# EAGLE design qo-100-opi-dock (EAGLE 9.6.1)
CNAME: None; CREVISION: 1; DESIGNER: Joao Silva

## Sheet 1 of 5: SBC
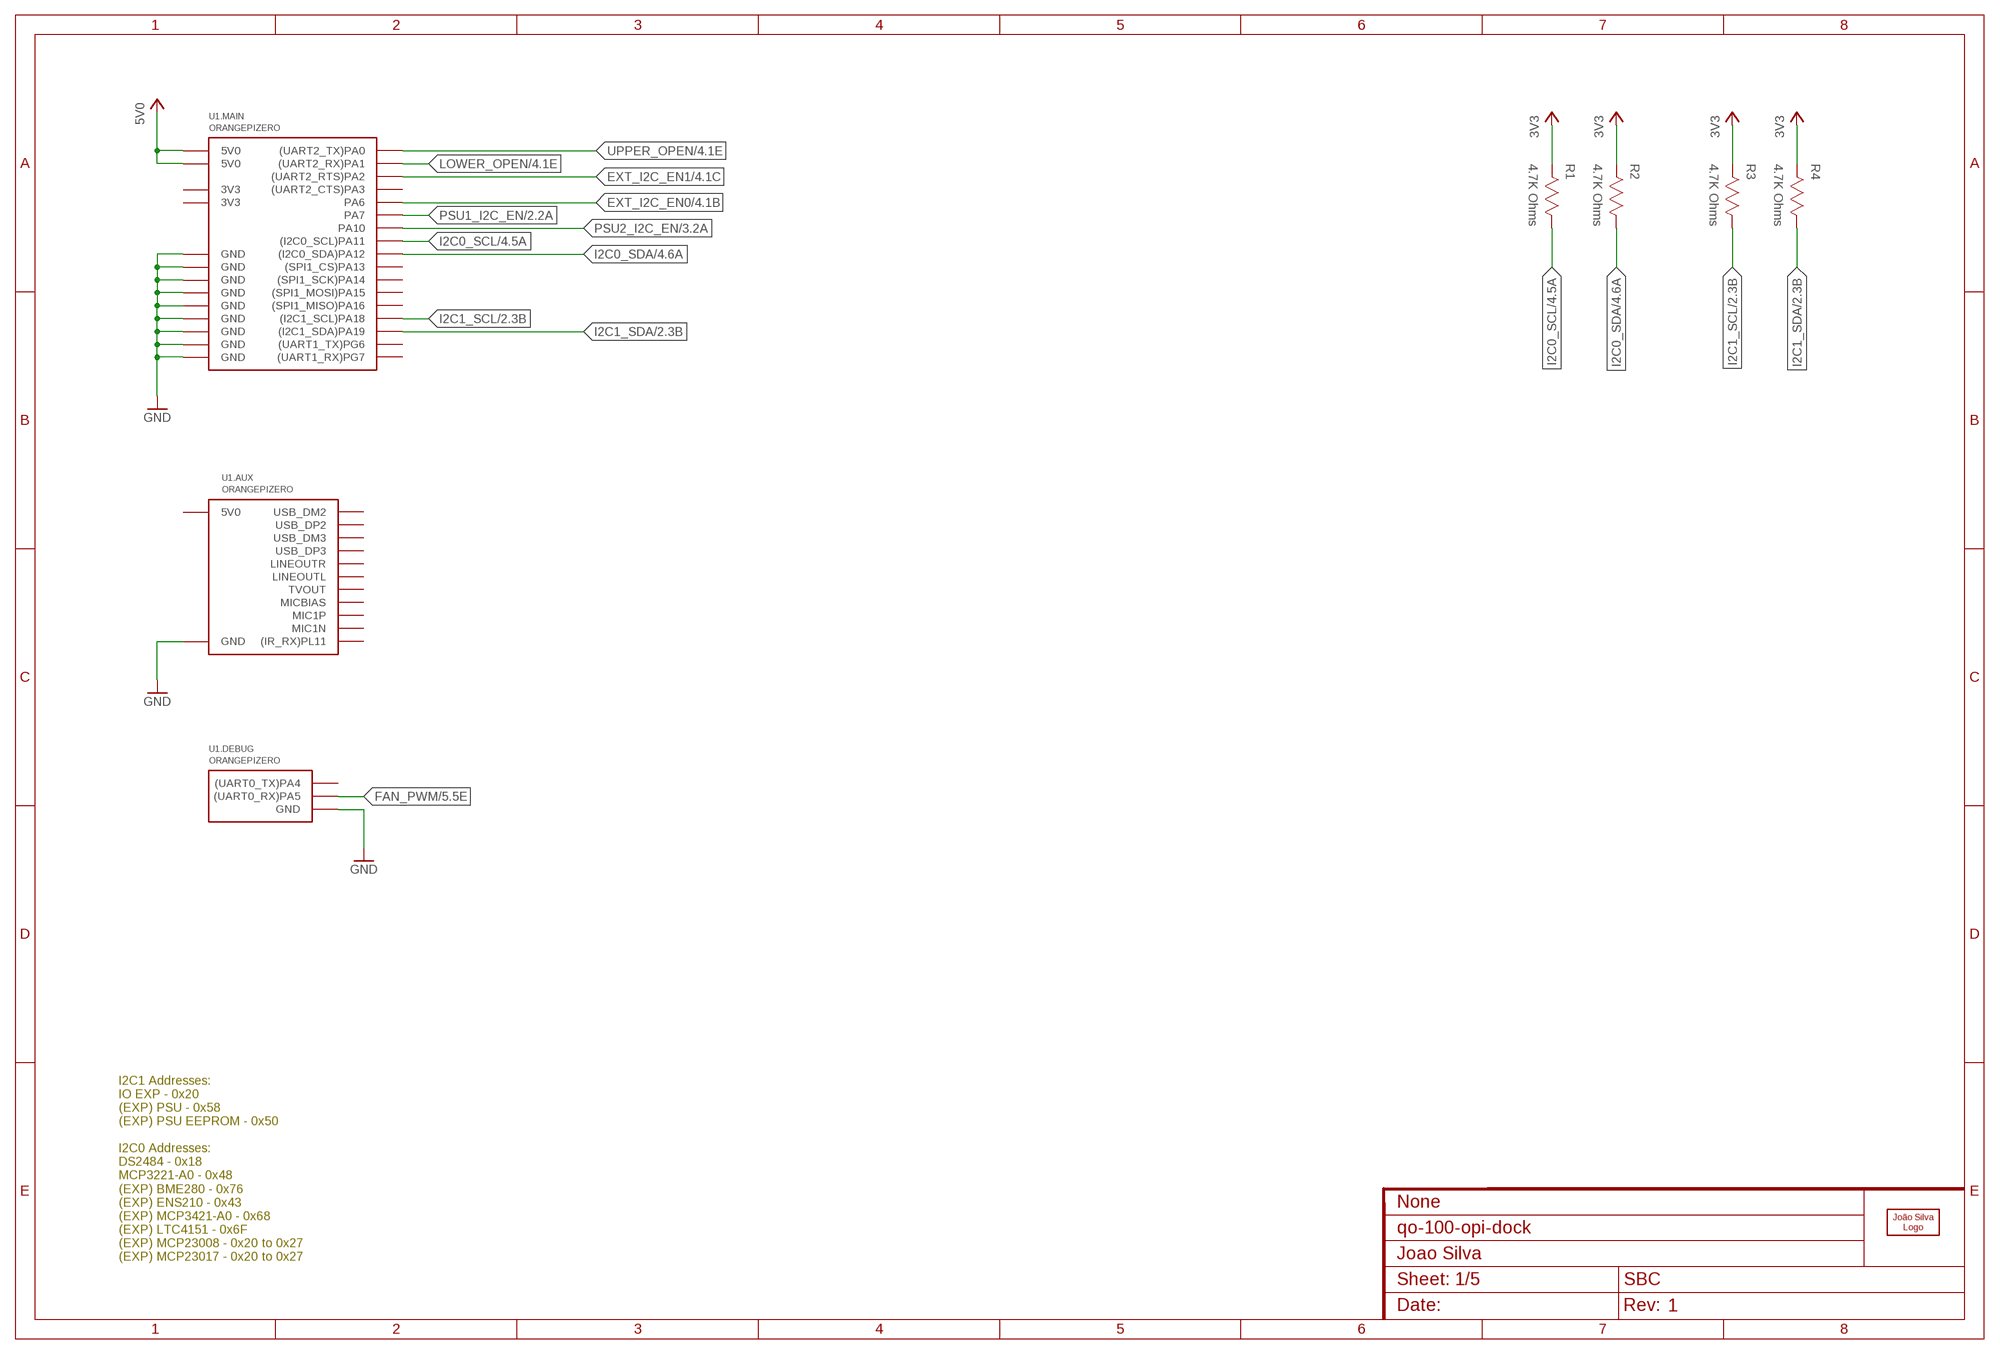
[diagram p0: schematic, sheet 1]

### Parts
LOGO1  JS-5MM  [JS_5MM]
R1  4.7K Ohms  RESISTOR-0603  [RES0603]
R2  4.7K Ohms  RESISTOR-0603  [RES0603]
R3  4.7K Ohms  RESISTOR-0603  [RES0603]
R4  4.7K Ohms  RESISTOR-0603  [RES0603]
U1  ORANGEPIZERO  [ORANGEPIZERO]

### Nets
3V3: R1.2 R2.2 R3.2 R4.2 ; also sheet 2,3,4,5
5V0: U1.MH$2(.MAIN:5V0) U1.MH$4(.MAIN:5V0) ; also sheet 5
EXT_I2C_EN0: U1.MH$7(.MAIN:PA6) ; also sheet 4
EXT_I2C_EN1: U1.MH$22(.MAIN:(UART2_RTS)PA2) ; also sheet 4
FAN_PWM: U1.DBG$2(.DEBUG:(UART0_RX)PA5) ; also sheet 5
GND: U1.DBG$1(.DEBUG:GND) U1.GND@0(.MAIN:GND) U1.GND@1(.MAIN:GND) U1.GND@2(.MAIN:GND) U1.GND@3(.MAIN:GND) U1.MH$6(.MAIN:GND) U1.MH$9(.MAIN:GND) U1.MH$14(.MAIN:GND) U1.MH$20(.MAIN:GND) U1.MH$25(.MAIN:GND) U1.SH$2(.AUX:GND) ; also sheet 2,3,4,5
I2C0_SCL: R1.1 U1.MH$5(.MAIN:(I2C0_SCL)PA11) ; also sheet 4,5
I2C0_SDA: R2.1 U1.MH$3(.MAIN:(I2C0_SDA)PA12) ; also sheet 4,5
I2C1_SCL: R3.1 U1.MH$18(.MAIN:(I2C1_SCL)PA18) ; also sheet 2,3
I2C1_SDA: R4.1 U1.MH$16(.MAIN:(I2C1_SDA)PA19) ; also sheet 2,3
LOWER_OPEN: U1.MH$11(.MAIN:(UART2_RX)PA1) ; also sheet 4
PSU1_I2C_EN: U1.MH$12(.MAIN:PA7) ; also sheet 2
PSU2_I2C_EN: U1.MH$26(.MAIN:PA10) ; also sheet 3
UPPER_OPEN: U1.MH$13(.MAIN:(UART2_TX)PA0) ; also sheet 4
Unconnected: U1.DBG$3(.DEBUG:(UART0_TX)PA4) U1.MH$1(.MAIN:3V3) U1.MH$8(.MAIN:(UART1_TX)PG6) U1.MH$10(.MAIN:(UART1_RX)PG7) U1.MH$15(.MAIN:(UART2_CTS)PA3) U1.MH$17(.MAIN:3V3) U1.MH$19(.MAIN:(SPI1_MOSI)PA15) U1.MH$21(.MAIN:(SPI1_MISO)PA16) U1.MH$23(.MAIN:(SPI1_SCK)PA14) U1.MH$24(.MAIN:(SPI1_CS)PA13) U1.SH$1(.AUX:5V0) U1.SH$3(.AUX:USB_DM2) U1.SH$4(.AUX:USB_DP2) U1.SH$5(.AUX:USB_DM3) U1.SH$6(.AUX:USB_DP3) U1.SH$7(.AUX:LINEOUTR) U1.SH$8(.AUX:LINEOUTL) U1.SH$9(.AUX:TVOUT) U1.SH$10(.AUX:MICBIAS) U1.SH$11(.AUX:MIC1P) U1.SH$12(.AUX:MIC1N) U1.SH$13(.AUX:(IR_RX)PL11)

### Notes on the sheet
- I2C1 Addresses:
  IO EXP - 0x20
  (EXP) PSU - 0x58
  (EXP) PSU EEPROM - 0x50
  
  I2C0 Addresses:
  DS2484 - 0x18
  MCP3221-A0 - 0x48
  (EXP) BME280 - 0x76
  (EXP) ENS210 - 0x43
  (EXP) MCP3421-A0 - 0x68
  (EXP) LTC4151 - 0x6F
  (EXP) MCP23008 - 0x20 to 0x27
  (EXP) MCP23017 - 0x20 to 0x27

## Sheet 2 of 5: PSU #1 Interface
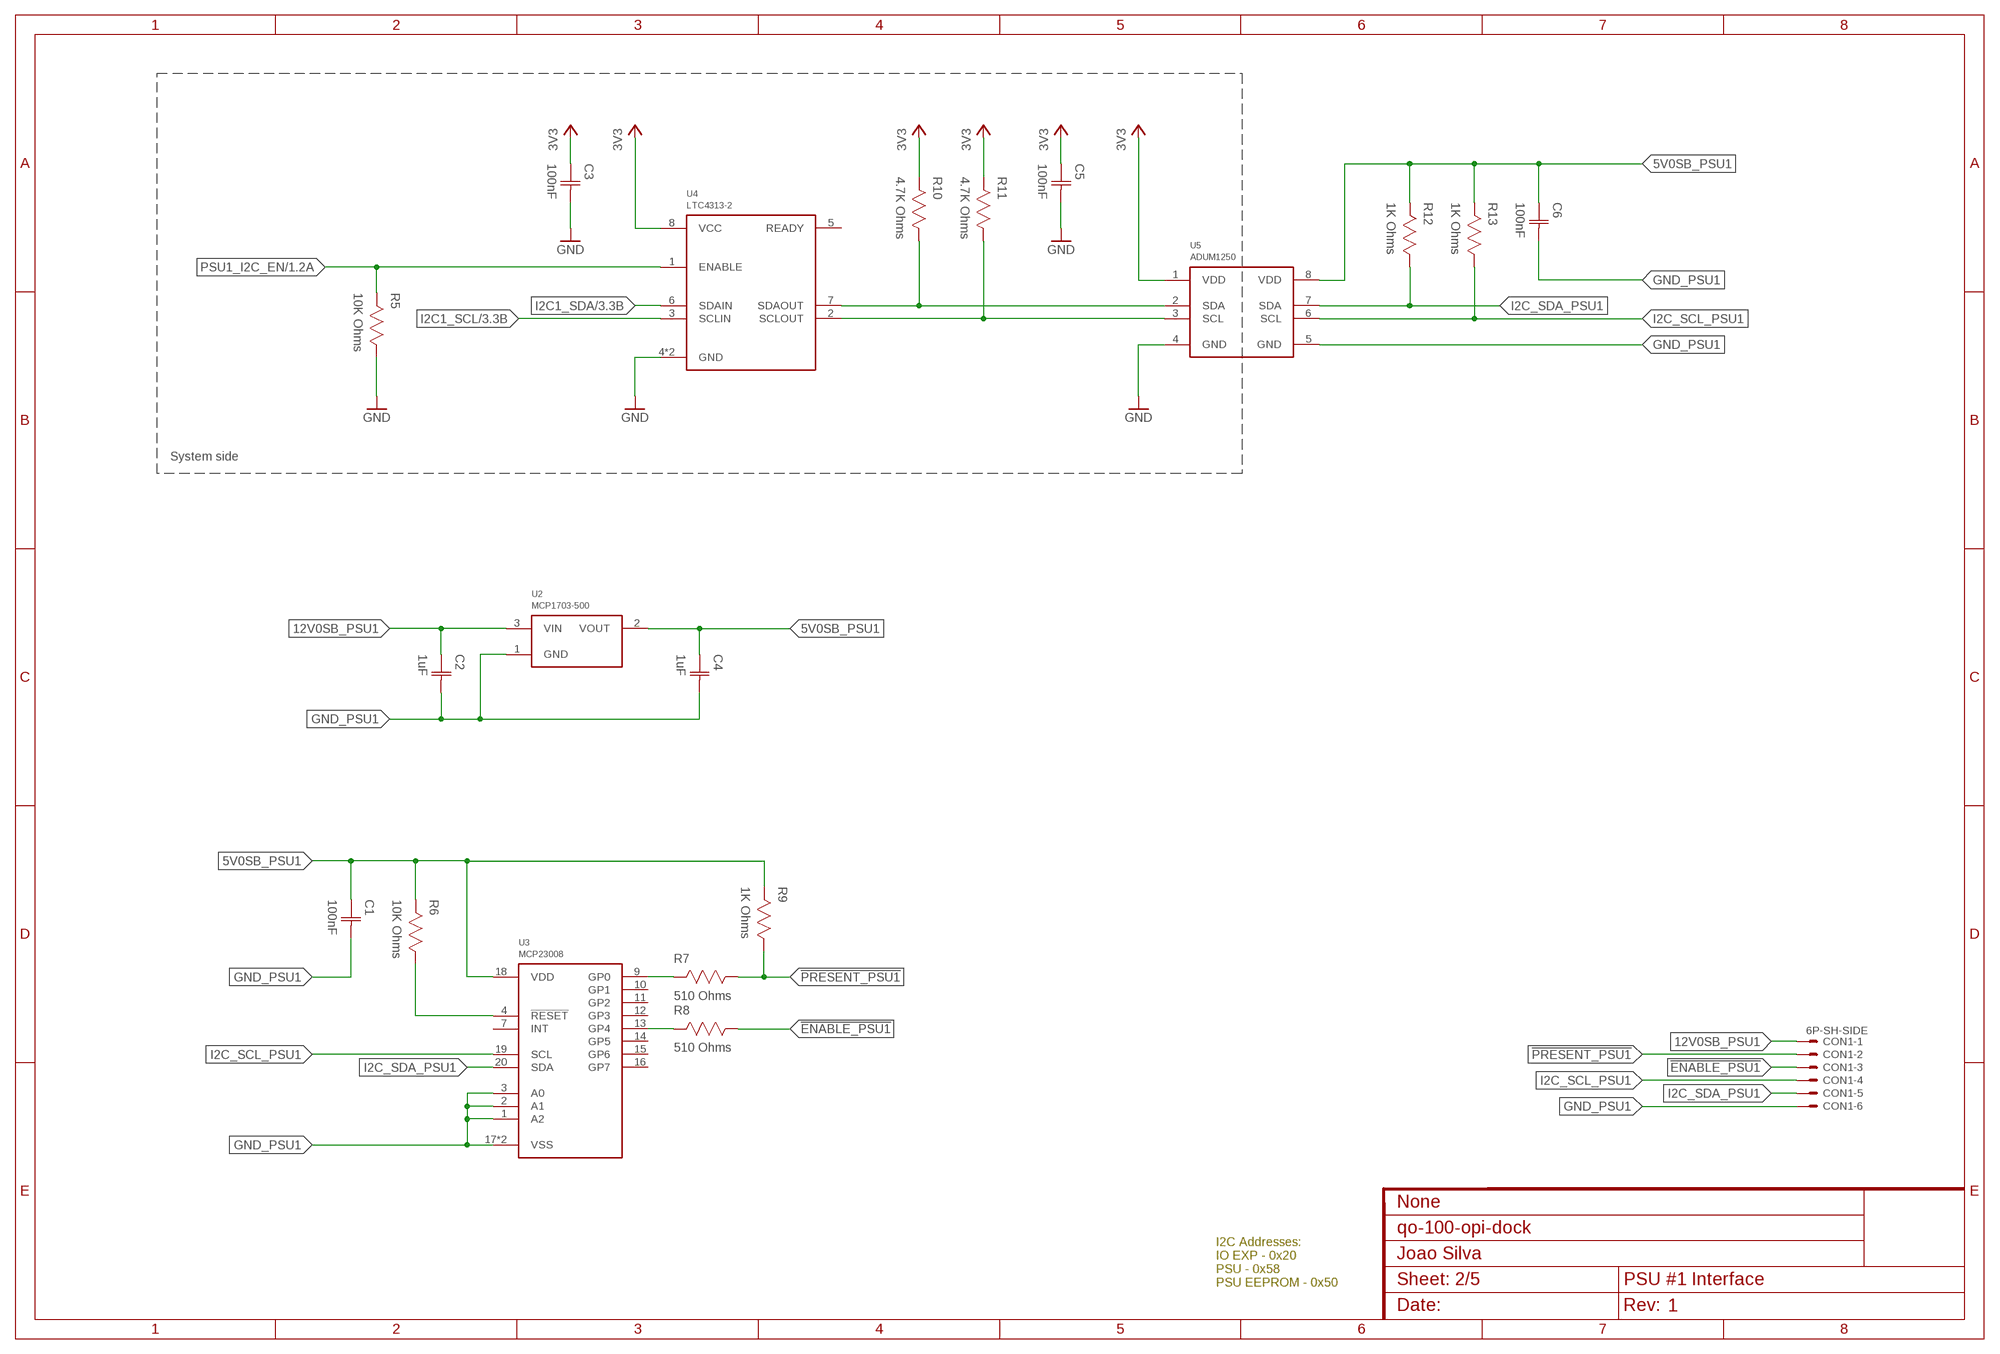
[diagram p1: schematic, sheet 2]

### Parts
C1  100nF  CAPACITOR-0603  [CAP0603]
C2  1uF  CAPACITOR-0603  [CAP0603]
C3  100nF  CAPACITOR-0603  [CAP0603]
C4  1uF  CAPACITOR-0603  [CAP0603]
C5  100nF  CAPACITOR-0603  [CAP0603]
C6  100nF  CAPACITOR-0603  [CAP0603]
CON1  6P-SH-SIDE  [SH-06-SIDE]
R5  10K Ohms  RESISTOR-0603  [RES0603]
R6  10K Ohms  RESISTOR-0603  [RES0603]
R7  510 Ohms  RESISTOR-0603  [RES0603]
R8  510 Ohms  RESISTOR-0603  [RES0603]
R9  1K Ohms  RESISTOR-0603  [RES0603]
R10  4.7K Ohms  RESISTOR-0603  [RES0603]
R11  4.7K Ohms  RESISTOR-0603  [RES0603]
R12  1K Ohms  RESISTOR-0603  [RES0603]
R13  1K Ohms  RESISTOR-0603  [RES0603]
U2  MCP1703-500  [SOT23]
U3  MCP23008  [QFN20]
U4  LTC4313-2  [DFN8]
U5  ADUM1250  [SOIC8]

### Nets
3V3: C3.1(C1) C5.1(C1) R10.2 R11.2 U4.8(VCC) U5.1(VDD) ; also sheet 1,3,4,5
5V0SB_PSU1: C1.1(C1) C4.1(C1) C6.1(C1) R6.2 R9.2 R12.2 R13.2 U2.2(VOUT) U3.18(VDD) U5.8(VDD)
12V0SB_PSU1: C2.1(C1) CON1.1 U2.3(VIN)
!ENABLE_PSU1: CON1.3 R8.1
!PRESENT_PSU1: CON1.2 R7.1 R9.1
GND: C3.2(C2) C5.2(C2) R5.1 U4.4(GND) U4.9(GND) U5.4(GND) ; also sheet 1,3,4,5
GND_PSU1: C1.2(C2) C2.2(C2) C4.2(C2) C6.2(C2) CON1.6 U2.1(GND) U3.1(A2) U3.2(A1) U3.3(A0) U3.17(VSS) U3.PAD(VSS) U5.5(GND)
I2C1_SCL: U4.3(SCLIN) ; also sheet 1,3
I2C1_SDA: U4.6(SDAIN) ; also sheet 1,3
I2C_SCL_PSU1: CON1.4 R13.1 U3.19(SCL) U5.6(SCL)
I2C_SDA_PSU1: CON1.5 R12.1 U3.20(SDA) U5.7(SDA)
N$1: R11.1 U4.2(SCLOUT) U5.3(SCL)
N$2: R10.1 U4.7(SDAOUT) U5.2(SDA)
N$3: R6.1 U3.4(!RESET)
N$4: R8.2 U3.13(GP4)
N$5: R7.2 U3.9(GP0)
PSU1_I2C_EN: R5.2 U4.1(ENABLE) ; also sheet 1
Unconnected: U3.7(INT) U3.10(GP1) U3.11(GP2) U3.12(GP3) U3.14(GP5) U3.15(GP6) U3.16(GP7) U4.5(READY)

### Notes on the sheet
- System side
- I2C Addresses:
  IO EXP - 0x20
  PSU - 0x58
  PSU EEPROM - 0x50

## Sheet 3 of 5: PSU #2 Interface
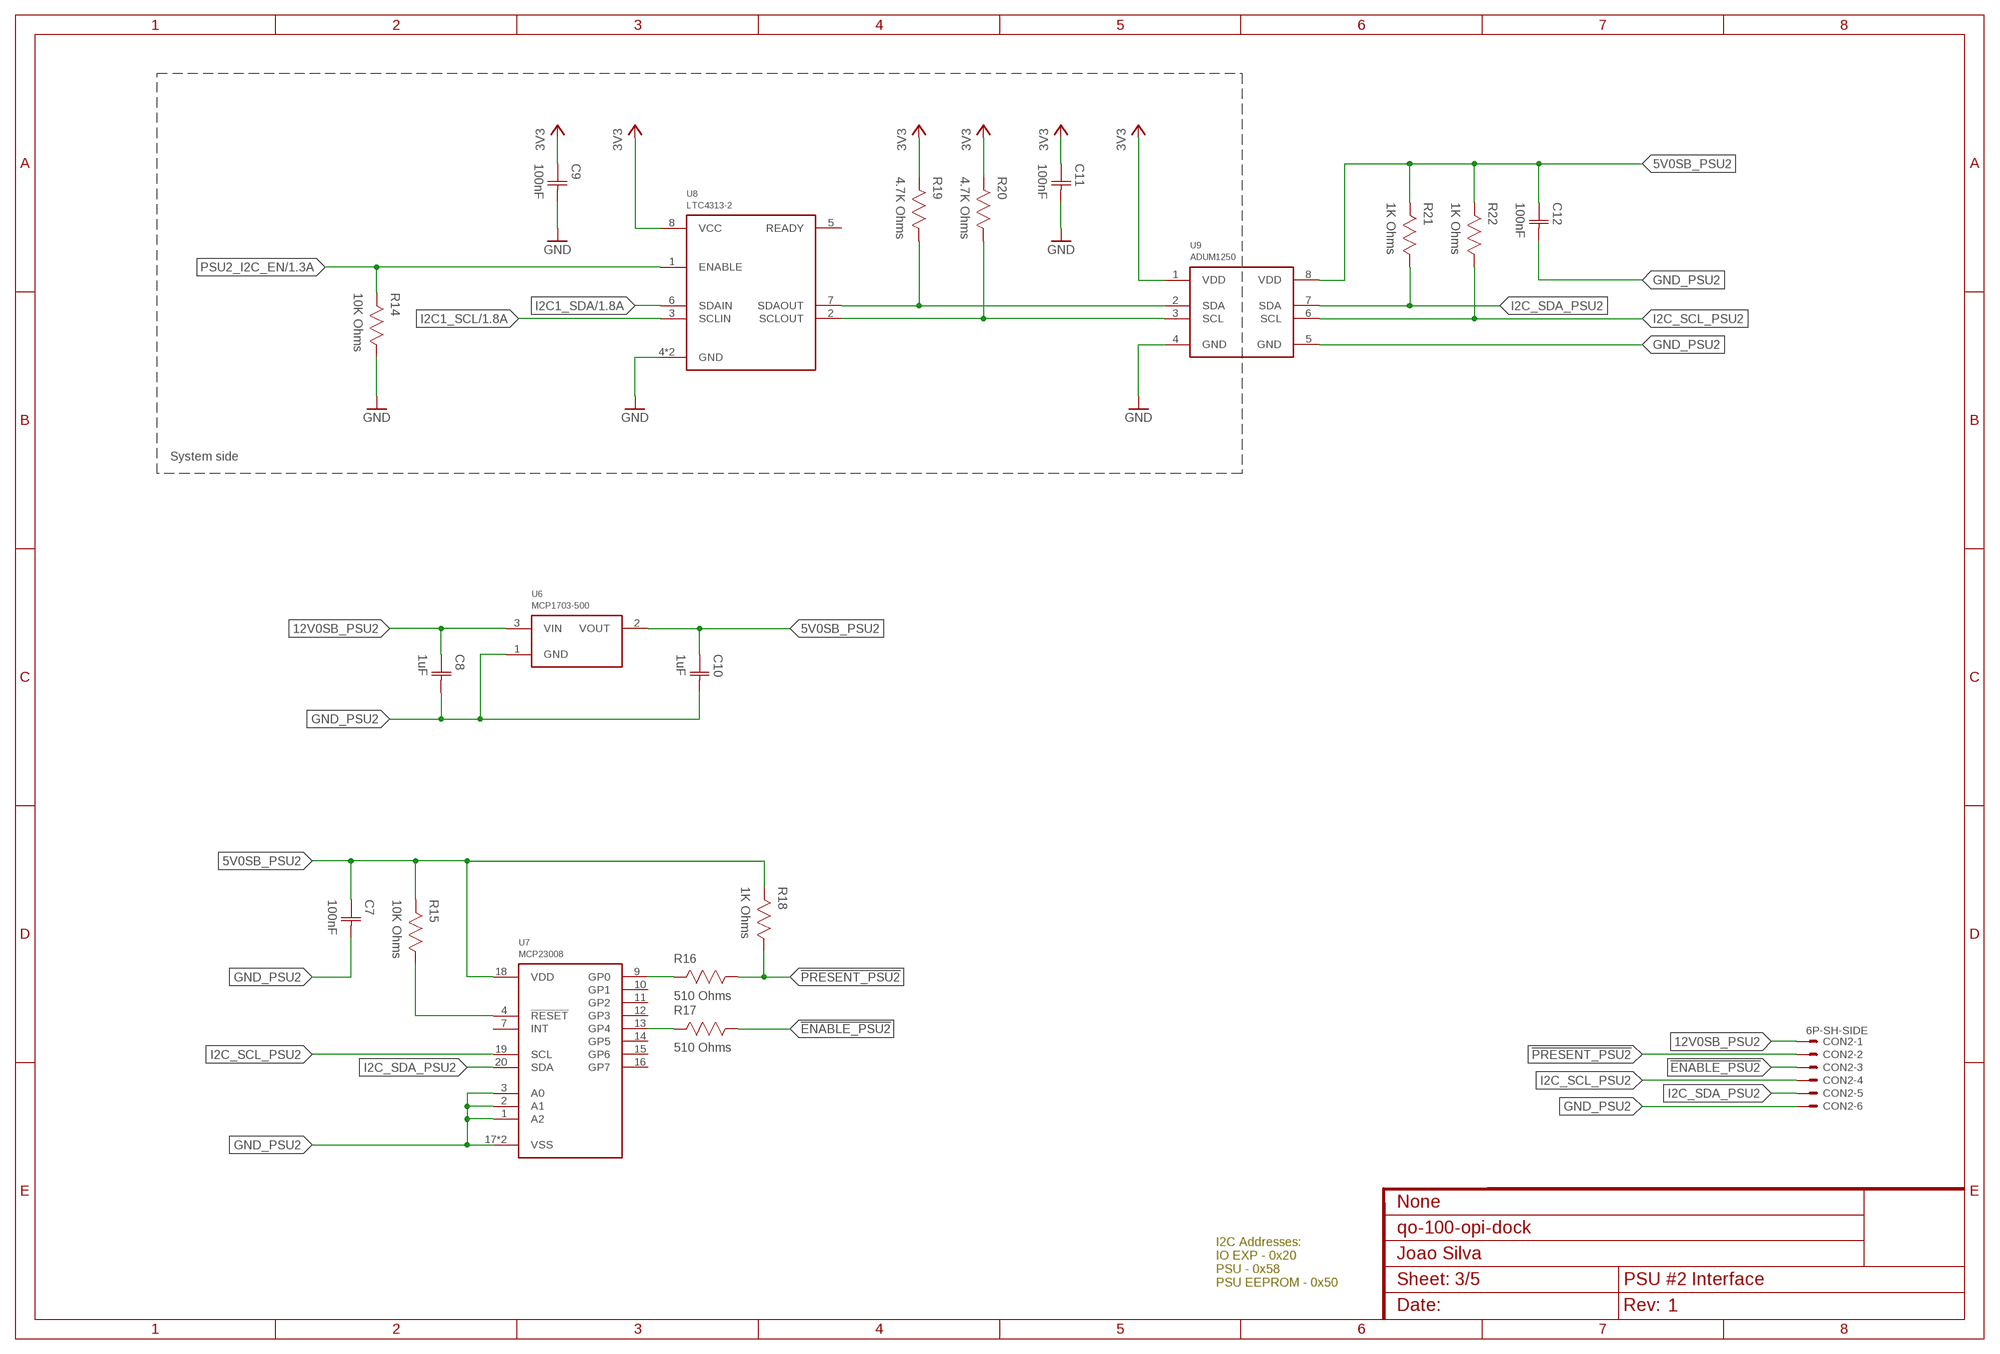
[diagram p2: schematic, sheet 3]

### Parts
C7  100nF  CAPACITOR-0603  [CAP0603]
C8  1uF  CAPACITOR-0603  [CAP0603]
C9  100nF  CAPACITOR-0603  [CAP0603]
C10  1uF  CAPACITOR-0603  [CAP0603]
C11  100nF  CAPACITOR-0603  [CAP0603]
C12  100nF  CAPACITOR-0603  [CAP0603]
CON2  6P-SH-SIDE  [SH-06-SIDE]
R14  10K Ohms  RESISTOR-0603  [RES0603]
R15  10K Ohms  RESISTOR-0603  [RES0603]
R16  510 Ohms  RESISTOR-0603  [RES0603]
R17  510 Ohms  RESISTOR-0603  [RES0603]
R18  1K Ohms  RESISTOR-0603  [RES0603]
R19  4.7K Ohms  RESISTOR-0603  [RES0603]
R20  4.7K Ohms  RESISTOR-0603  [RES0603]
R21  1K Ohms  RESISTOR-0603  [RES0603]
R22  1K Ohms  RESISTOR-0603  [RES0603]
U6  MCP1703-500  [SOT23]
U7  MCP23008  [QFN20]
U8  LTC4313-2  [DFN8]
U9  ADUM1250  [SOIC8]

### Nets
3V3: C9.1(C1) C11.1(C1) R19.2 R20.2 U8.8(VCC) U9.1(VDD) ; also sheet 1,2,4,5
5V0SB_PSU2: C7.1(C1) C10.1(C1) C12.1(C1) R15.2 R18.2 R21.2 R22.2 U6.2(VOUT) U7.18(VDD) U9.8(VDD)
12V0SB_PSU2: C8.1(C1) CON2.1 U6.3(VIN)
!ENABLE_PSU2: CON2.3 R17.1
!PRESENT_PSU2: CON2.2 R16.1 R18.1
GND: C9.2(C2) C11.2(C2) R14.1 U8.4(GND) U8.9(GND) U9.4(GND) ; also sheet 1,2,4,5
GND_PSU2: C7.2(C2) C8.2(C2) C10.2(C2) C12.2(C2) CON2.6 U6.1(GND) U7.1(A2) U7.2(A1) U7.3(A0) U7.17(VSS) U7.PAD(VSS) U9.5(GND)
I2C1_SCL: U8.3(SCLIN) ; also sheet 1,2
I2C1_SDA: U8.6(SDAIN) ; also sheet 1,2
I2C_SCL_PSU2: CON2.4 R22.1 U7.19(SCL) U9.6(SCL)
I2C_SDA_PSU2: CON2.5 R21.1 U7.20(SDA) U9.7(SDA)
N$6: R20.1 U8.2(SCLOUT) U9.3(SCL)
N$7: R19.1 U8.7(SDAOUT) U9.2(SDA)
N$8: R15.1 U7.4(!RESET)
N$9: R17.2 U7.13(GP4)
N$10: R16.2 U7.9(GP0)
PSU2_I2C_EN: R14.2 U8.1(ENABLE) ; also sheet 1
Unconnected: U7.7(INT) U7.10(GP1) U7.11(GP2) U7.12(GP3) U7.14(GP5) U7.15(GP6) U7.16(GP7) U8.5(READY)

### Notes on the sheet
- System side
- I2C Addresses:
  IO EXP - 0x20
  PSU - 0x58
  PSU EEPROM - 0x50

## Sheet 4 of 5: Interface
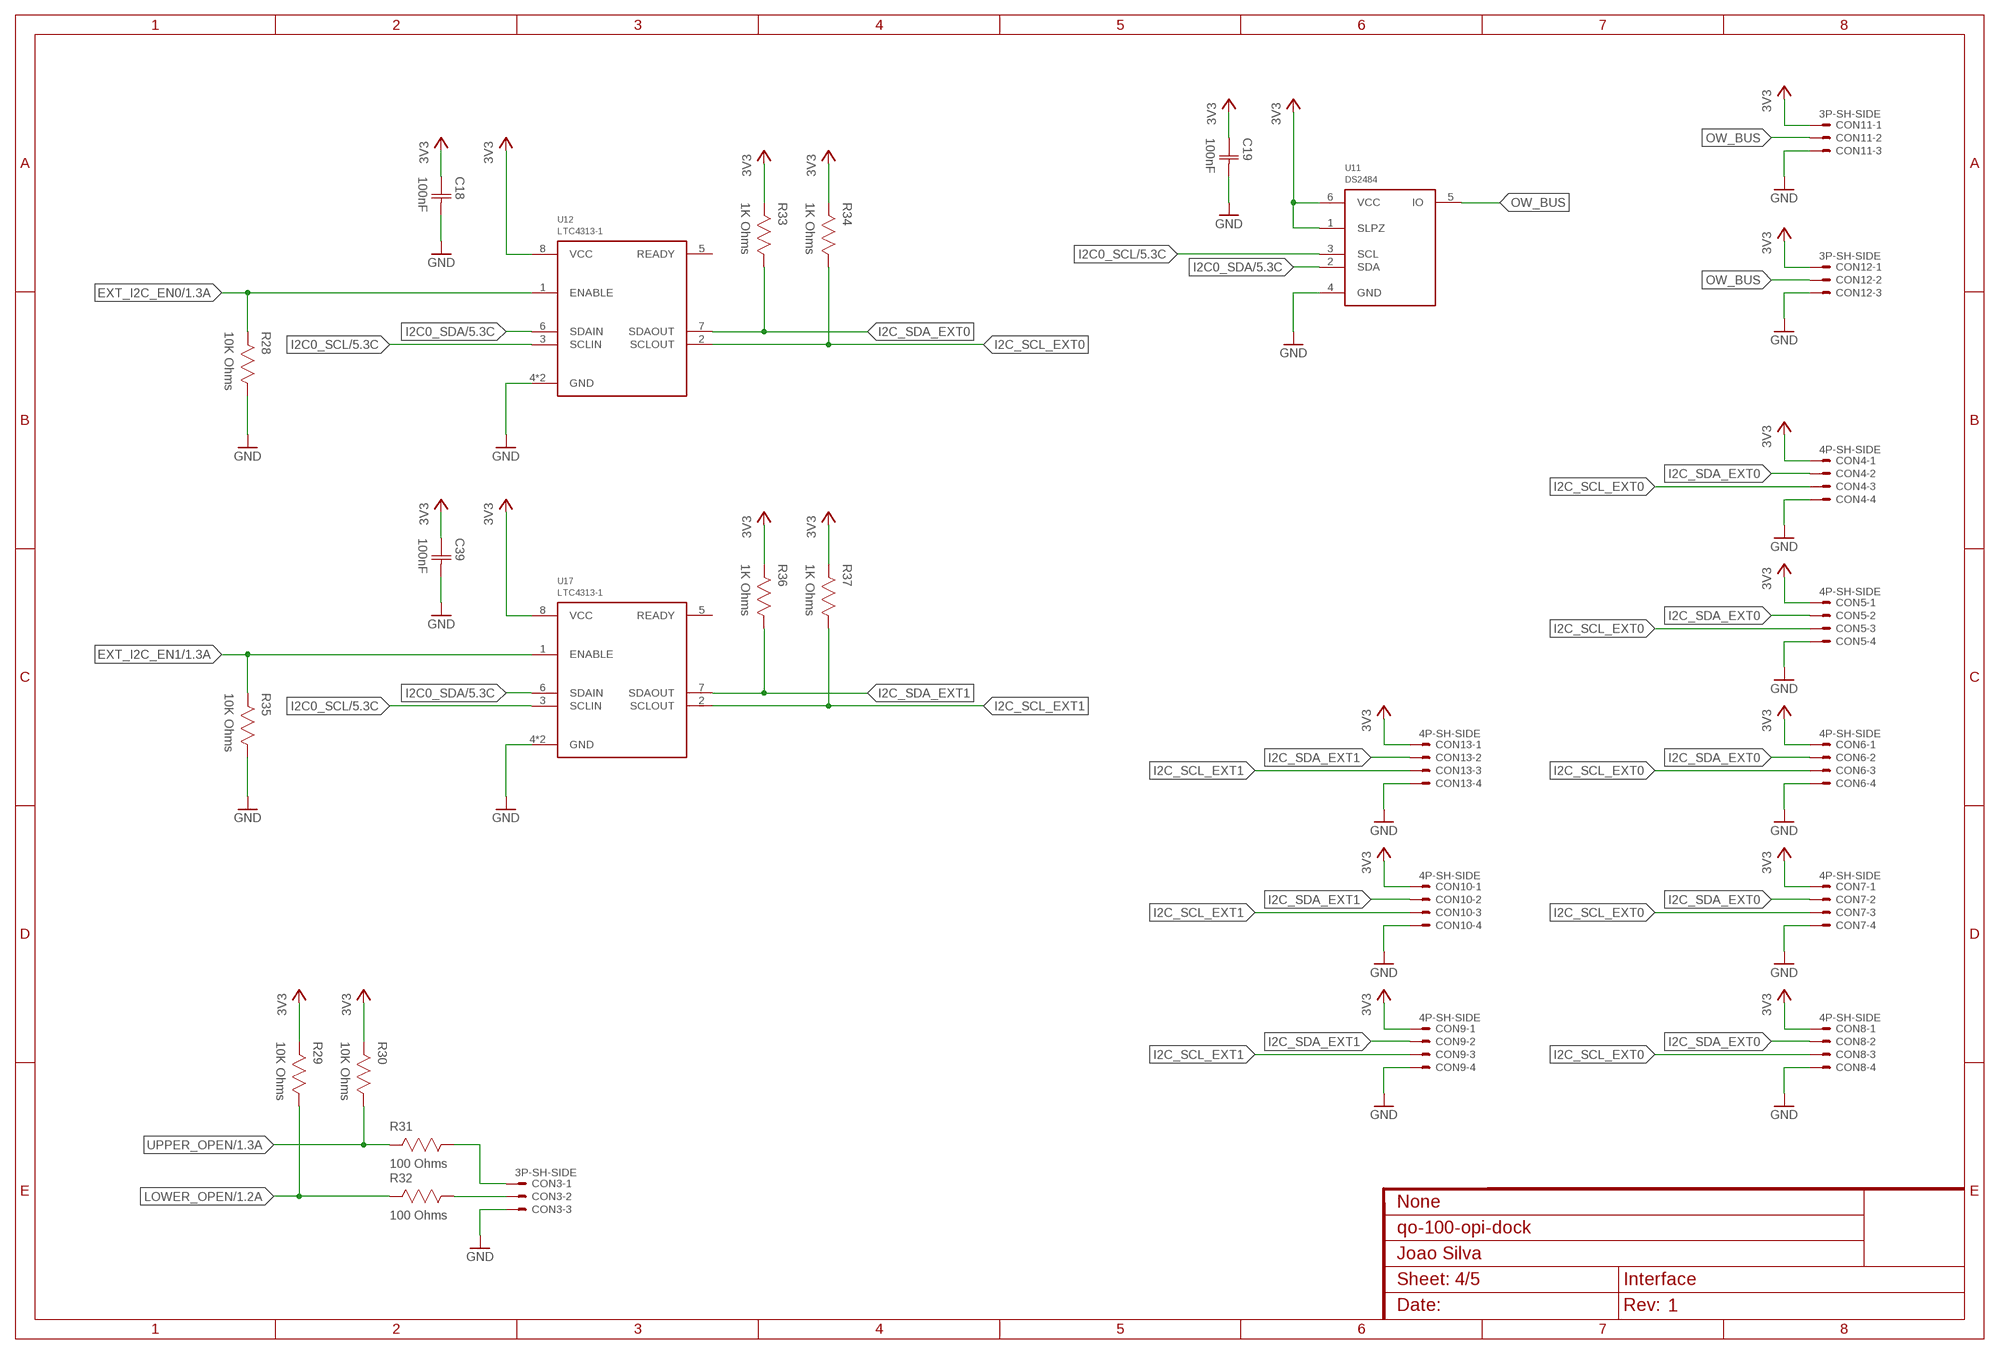
[diagram p3: schematic, sheet 4]

### Parts
C18  100nF  CAPACITOR-0603  [CAP0603]
C19  100nF  CAPACITOR-0603  [CAP0603]
C39  100nF  CAPACITOR-0603  [CAP0603]
CON3  3P-SH-SIDE  [SH-03-SIDE]
CON4  4P-SH-SIDE  [SH-04-SIDE]
CON5  4P-SH-SIDE  [SH-04-SIDE]
CON6  4P-SH-SIDE  [SH-04-SIDE]
CON7  4P-SH-SIDE  [SH-04-SIDE]
CON8  4P-SH-SIDE  [SH-04-SIDE]
CON9  4P-SH-SIDE  [SH-04-SIDE]
CON10  4P-SH-SIDE  [SH-04-SIDE]
CON11  3P-SH-SIDE  [SH-03-SIDE]
CON12  3P-SH-SIDE  [SH-03-SIDE]
CON13  4P-SH-SIDE  [SH-04-SIDE]
R28  10K Ohms  RESISTOR-0603  [RES0603]
R29  10K Ohms  RESISTOR-0603  [RES0603]
R30  10K Ohms  RESISTOR-0603  [RES0603]
R31  100 Ohms  RESISTOR-0603  [RES0603]
R32  100 Ohms  RESISTOR-0603  [RES0603]
R33  1K Ohms  RESISTOR-0603  [RES0603]
R34  1K Ohms  RESISTOR-0603  [RES0603]
R35  10K Ohms  RESISTOR-0603  [RES0603]
R36  1K Ohms  RESISTOR-0603  [RES0603]
R37  1K Ohms  RESISTOR-0603  [RES0603]
U11  DS2484  [SOT23-6]
U12  LTC4313-1  [DFN8]
U17  LTC4313-1  [DFN8]

### Nets
3V3: C18.1(C1) C19.1(C1) C39.1(C1) CON4.1 CON5.1 CON6.1 CON7.1 CON8.1 CON9.1 CON10.1 CON11.1 CON12.1 CON13.1 R29.2 R30.2 R33.2 R34.2 R36.2 R37.2 U11.1(SLPZ) U11.6(VCC) U12.8(VCC) U17.8(VCC) ; also sheet 1,2,3,5
EXT_I2C_EN0: R28.2 U12.1(ENABLE) ; also sheet 1
EXT_I2C_EN1: R35.2 U17.1(ENABLE) ; also sheet 1
GND: C18.2(C2) C19.2(C2) C39.2(C2) CON3.3 CON4.4 CON5.4 CON6.4 CON7.4 CON8.4 CON9.4 CON10.4 CON11.3 CON12.3 CON13.4 R28.1 R35.1 U11.4(GND) U12.4(GND) U12.9(GND) U17.4(GND) U17.9(GND) ; also sheet 1,2,3,5
I2C0_SCL: U11.3(SCL) U12.3(SCLIN) U17.3(SCLIN) ; also sheet 1,5
I2C0_SDA: U11.2(SDA) U12.6(SDAIN) U17.6(SDAIN) ; also sheet 1,5
I2C_SCL_EXT0: CON4.3 CON5.3 CON6.3 CON7.3 CON8.3 R34.1 U12.2(SCLOUT)
I2C_SCL_EXT1: CON9.3 CON10.3 CON13.3 R37.1 U17.2(SCLOUT)
I2C_SDA_EXT0: CON4.2 CON5.2 CON6.2 CON7.2 CON8.2 R33.1 U12.7(SDAOUT)
I2C_SDA_EXT1: CON9.2 CON10.2 CON13.2 R36.1 U17.7(SDAOUT)
LOWER_OPEN: R29.1 R32.2 ; also sheet 1
N$26: CON3.2 R32.1
N$27: CON3.1 R31.1
OW_BUS: CON11.2 CON12.2 U11.5(IO)
UPPER_OPEN: R30.1 R31.2 ; also sheet 1
Unconnected: U12.5(READY) U17.5(READY)

## Sheet 5 of 5: Power
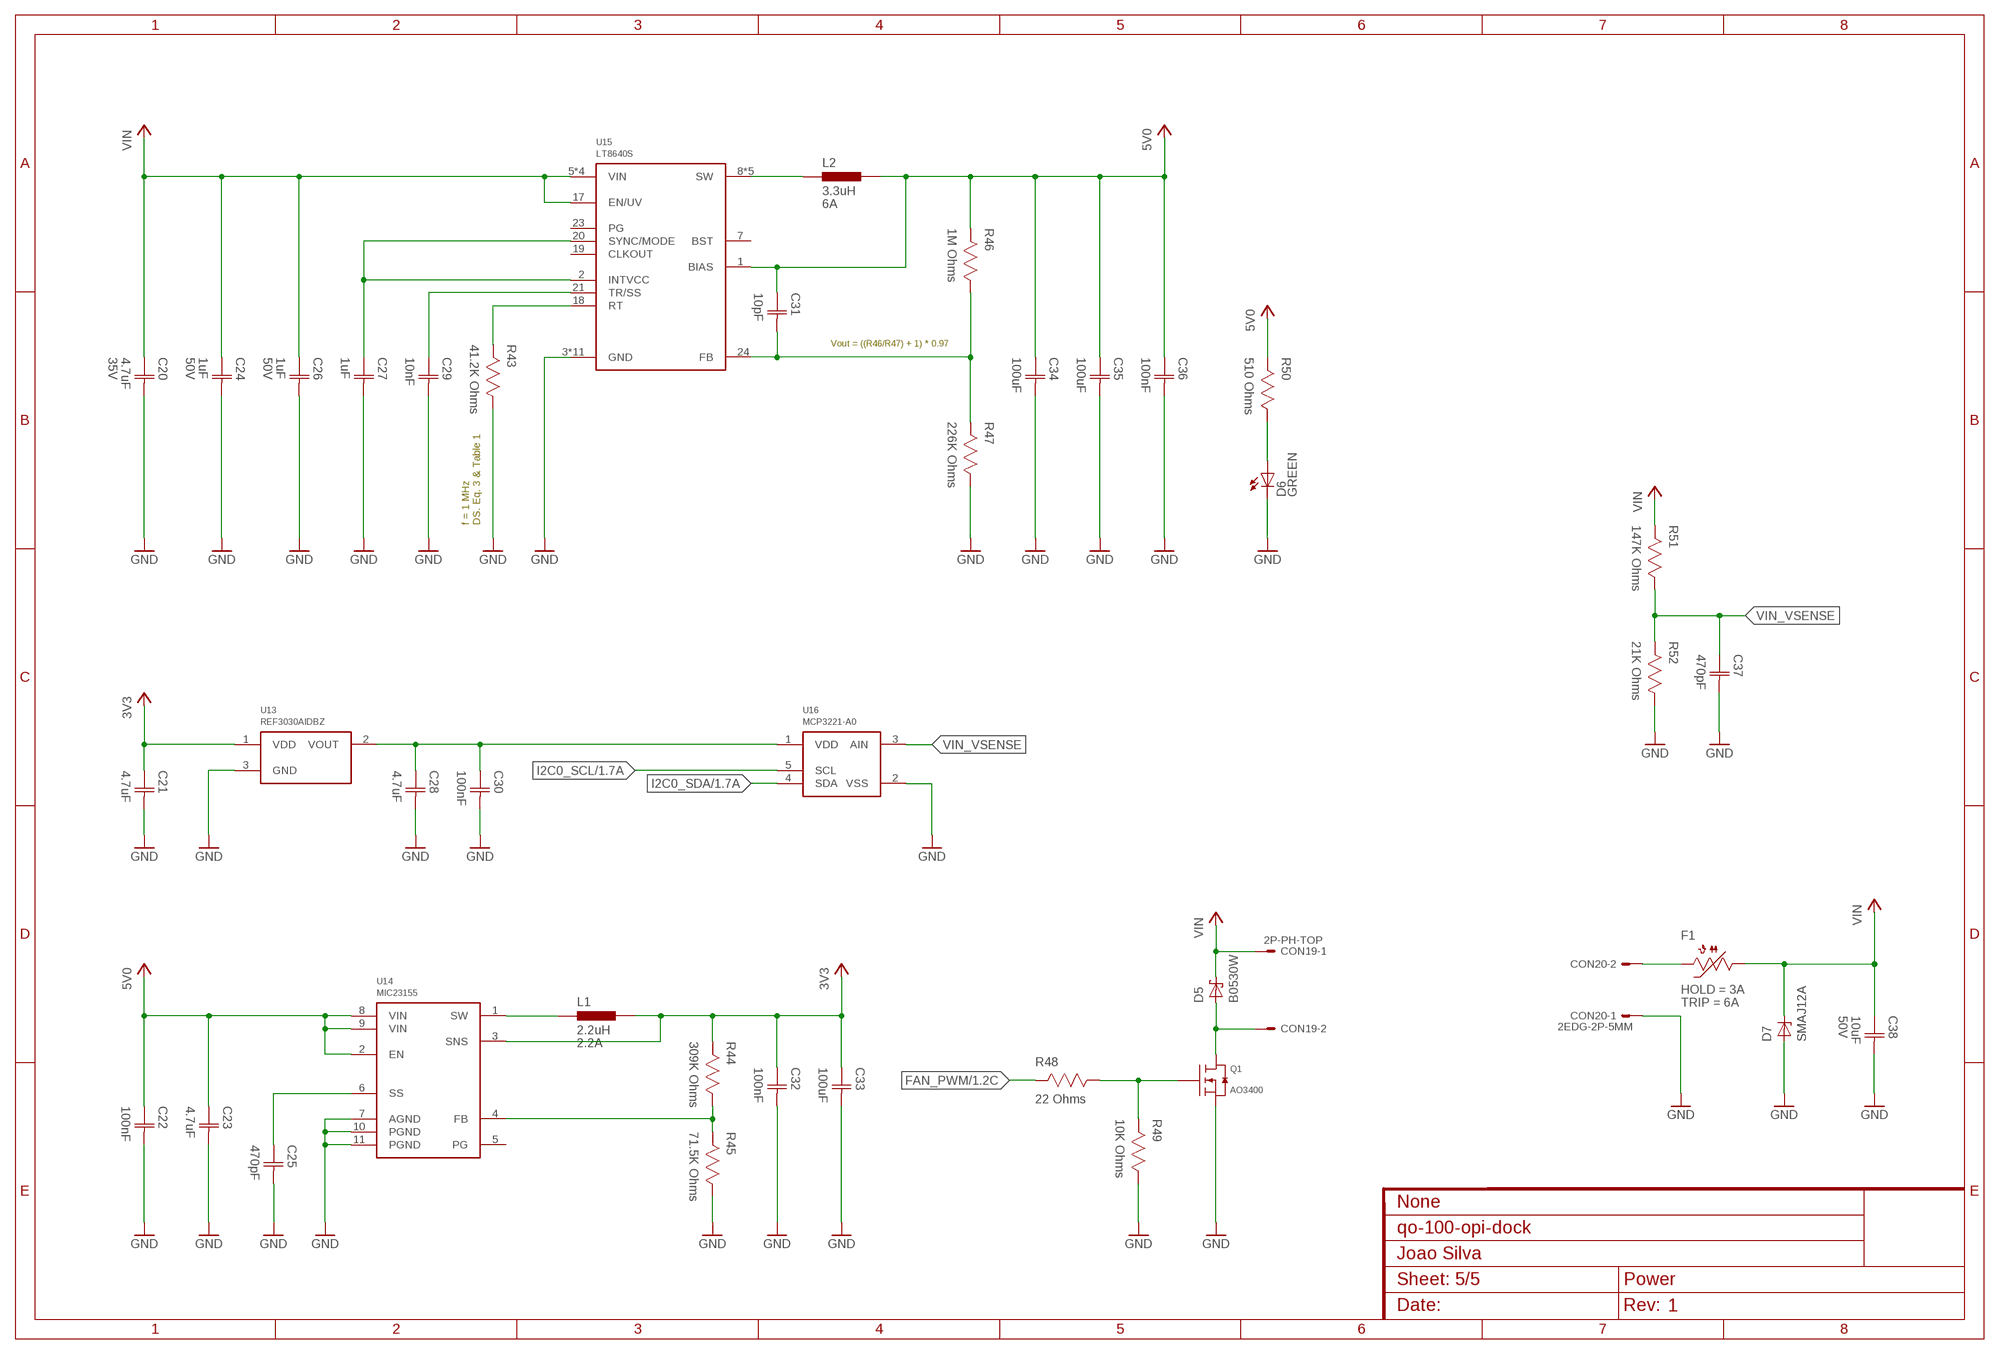
[diagram p4: schematic, sheet 5]

### Parts
C20  4.7uF  CAPACITOR-0603  [CAP0603]
C21  4.7uF  CAPACITOR-0603  [CAP0603]
C22  100nF  CAPACITOR-0603  [CAP0603]
C23  4.7uF  CAPACITOR-0603  [CAP0603]
C24  1uF  CAPACITOR-0603  [CAP0603]
C25  470pF  CAPACITOR-0603  [CAP0603]
C26  1uF  CAPACITOR-0603  [CAP0603]
C27  1uF  CAPACITOR-0603  [CAP0603]
C28  4.7uF  CAPACITOR-0603  [CAP0603]
C29  10nF  CAPACITOR-0603  [CAP0603]
C30  100nF  CAPACITOR-0603  [CAP0603]
C31  10pF  CAPACITOR-0603  [CAP0603]
C32  100nF  CAPACITOR-0603  [CAP0603]
C33  100uF  CAPACITOR-1206  [CAP1206]
C34  100uF  CAPACITOR-1206  [CAP1206]
C35  100uF  CAPACITOR-1206  [CAP1206]
C36  100nF  CAPACITOR-0603  [CAP0603]
C37  470pF  CAPACITOR-0603  [CAP0603]
C38  10uF  CAPACITOR-1206  [CAP1206]
CON19  2P-PH-TOP  [PH-02-TOP]
CON20  2EDG-2P-5MM  [2EDG-2P-5MM]
D5  B0530W  [SOD-123]
D6  LED0603  [0603]
D7  SMAJ12A  [DO214AC]
F1  2.6A Hold  PTC1206  [1206]
L1  2.2uH  INDUCTOR-2.5X2X1.2MM  [IND2520]
L2  3.3uH  INDUCTOR-6X6MM  [IND0606]
Q1  AO3400  [SOT23]
R43  41.2K Ohms  RESISTOR-0603  [RES0603]
R44  309K Ohms  RESISTOR-0603  [RES0603]
R45  71.5K Ohms  RESISTOR-0603  [RES0603]
R46  1M Ohms  RESISTOR-0603  [RES0603]
R47  226K Ohms  RESISTOR-0603  [RES0603]
R48  22 Ohms  RESISTOR-0603  [RES0603]
R49  10K Ohms  RESISTOR-0603  [RES0603]
R50  510 Ohms  RESISTOR-0603  [RES0603]
R51  147K Ohms  RESISTOR-0603  [RES0603]
R52  21K Ohms  RESISTOR-0603  [RES0603]
U13  REF3030AIDBZ  [SOT23]
U14  MIC23155  [DFN10]
U15  LT8640S  [QFN24_CORNER]
U16  MCP3221-A0  [SOT23-5]

### Nets
3V0_ADC_CLEAN: C28.1(C1) C30.1(C1) U13.2(VOUT) U16.1(VDD)
3V3: C21.1(C1) C32.1(C1) C33.1(C1) L1.2 R44.2 U13.1(VDD) U14.3(SNS) ; also sheet 1,2,3,4
3V3_FB: R44.1 R45.2 U14.4(FB)
3V3_SOFTSTART: C25.1(C1) U14.6(SS)
3V3_SW: L1.1 U14.1(SW)
5V0: C22.1(C1) C23.1(C1) C31.1(C1) C34.1(C1) C35.1(C1) C36.1(C1) L2.2 R46.2 R50.2 U14.2(EN) U14.8(VIN) U14.9(VIN) U15.1(BIAS) ; also sheet 1
5V0_FB: C31.2(C2) R46.1 R47.2 U15.24(FB)
5V0_INTVCC: C27.1(C1) U15.2(INTVCC) U15.20(SYNC/MODE)
5V0_RT: R43.2 U15.18(RT)
5V0_SS: C29.1(C1) U15.21(TR/SS)
5V0_SW: L2.1 U15.8(SW) U15.9(SW) U15.10(SW) U15.11(SW) U15.12(SW)
FAN_PWM: R48.2 ; also sheet 1
GND: C20.2(C2) C21.2(C2) C22.2(C2) C23.2(C2) C24.2(C2) C25.2(C2) C26.2(C2) C27.2(C2) C28.2(C2) C29.2(C2) C30.2(C2) C32.2(C2) C33.2(C2) C34.2(C2) C35.2(C2) C36.2(C2) C37.2(C2) C38.2(C2) CON20.P$1 D6.C D7.A Q1.2(S) R43.1 R45.1 R47.1 R49.1 R52.1 U13.3(GND) U14.7(AGND) U14.10(PGND) U14.11(PGND) U15.3(GND) U15.16(GND) U15.22(GND) U15.25(GND) U15.26(GND) U15.27(GND) U15.28(GND) U15.29(GND) U15.30(GND) U15.31(GND) U15.32(GND) U16.2(VSS) ; also sheet 1,2,3,4
I2C0_SCL: U16.5(SCL) ; also sheet 1,4
I2C0_SDA: U16.4(SDA) ; also sheet 1,4
N$19: CON20.P$2 F1.2
N$34: CON19.2 D5.A Q1.3(D)
N$35: Q1.1(G) R48.1 R49.2
N$149: D6.A R50.1
VIN: C20.1(C1) C24.1(C1) C26.1(C1) C38.1(C1) CON19.1 D5.C D7.C F1.1 R51.2 U15.5(VIN) U15.6(VIN) U15.13(VIN) U15.14(VIN) U15.17(EN/UV)
VIN_VSENSE: C37.1(C1) R51.1 R52.2 U16.3(AIN)
Unconnected: U14.5(PG) U15.7(BST) U15.19(CLKOUT) U15.23(PG)

### Notes on the sheet
- Vout = ((R46/R47) + 1) * 0.97
- f = 1 MHz
  DS. Eq. 3 & Table 1

## Library data of the parts
C1-C12 C18 C19 C21-C23 C25 C27-C37 C39 = Capacitor:CAPACITOR
C20 = Capacitor:CAPACITOR; VOLTAGE: 35V
C24 C26 C38 = Capacitor:CAPACITOR; VOLTAGE: 50V
CON1 CON2 = JST:6P: Disconnectable Crimp style connector, 1.0mm pitch 6 contacts
CON3 CON11 CON12 = JST:3P: Disconnectable Crimp style connector, 1.0mm pitch 3 contacts
CON4-CON10 CON13 = JST:4P: Disconnectable Crimp style connector, 1.0mm pitch 4 contacts
CON19 = JST:2P: Disconnectable Crimp style connector, 1.0mm pitch 2 contacts
CON20 = Generic Connector:2EDG-2P
D5 = Generic Diode:B0530W
D6 = LED:LED; COLOR: GREEN
D7 = TVS:SMAJ*A: SMAJ Series TVS Diodes Source: http://www.littelfuse.com/~/media/electronics/datasheets/tvs_diodes/littelfuse_tvs_diode_smaj_datasheet.pdf.pdf; MF: Littelfuse; MPN: SMAJ12A; OC_FARNELL: 1827602; OC_NEWARK: 71J1937
F1 = PTC Fuses:PTC; HOLD: 3A; OCLCSC: C207041; TRIP: 6A
L1 = Inductor:INDUCTOR; CURRENT: 2.2A; OCLCSC: C375952
L2 = Inductor:INDUCTOR; CURRENT: 6A
LOGO1 = Silkscreen:JS
Q1 = Alpha Omega:AO3400
R1-R22 R28-R37 R43-R52 = Resistor:RESISTOR
U1 = SBC:ORANGEPIZERO
U2 U6 = Microchip:MCP1703-*
U3 U7 = Microchip:MCP23008
U4 U8 U12 U17 = Analog Devices:LTC4313-*
U5 U9 = Analog Devices:ADUM1250
U11 = Maxim Integrated:DS2484
U13 = Texas Instruments:REF30*AIDBZ
U14 = Microchip:MIC23155
U15 = Analog Devices:LT8640S
U16 = Microchip:MCP3221-A*

## Board
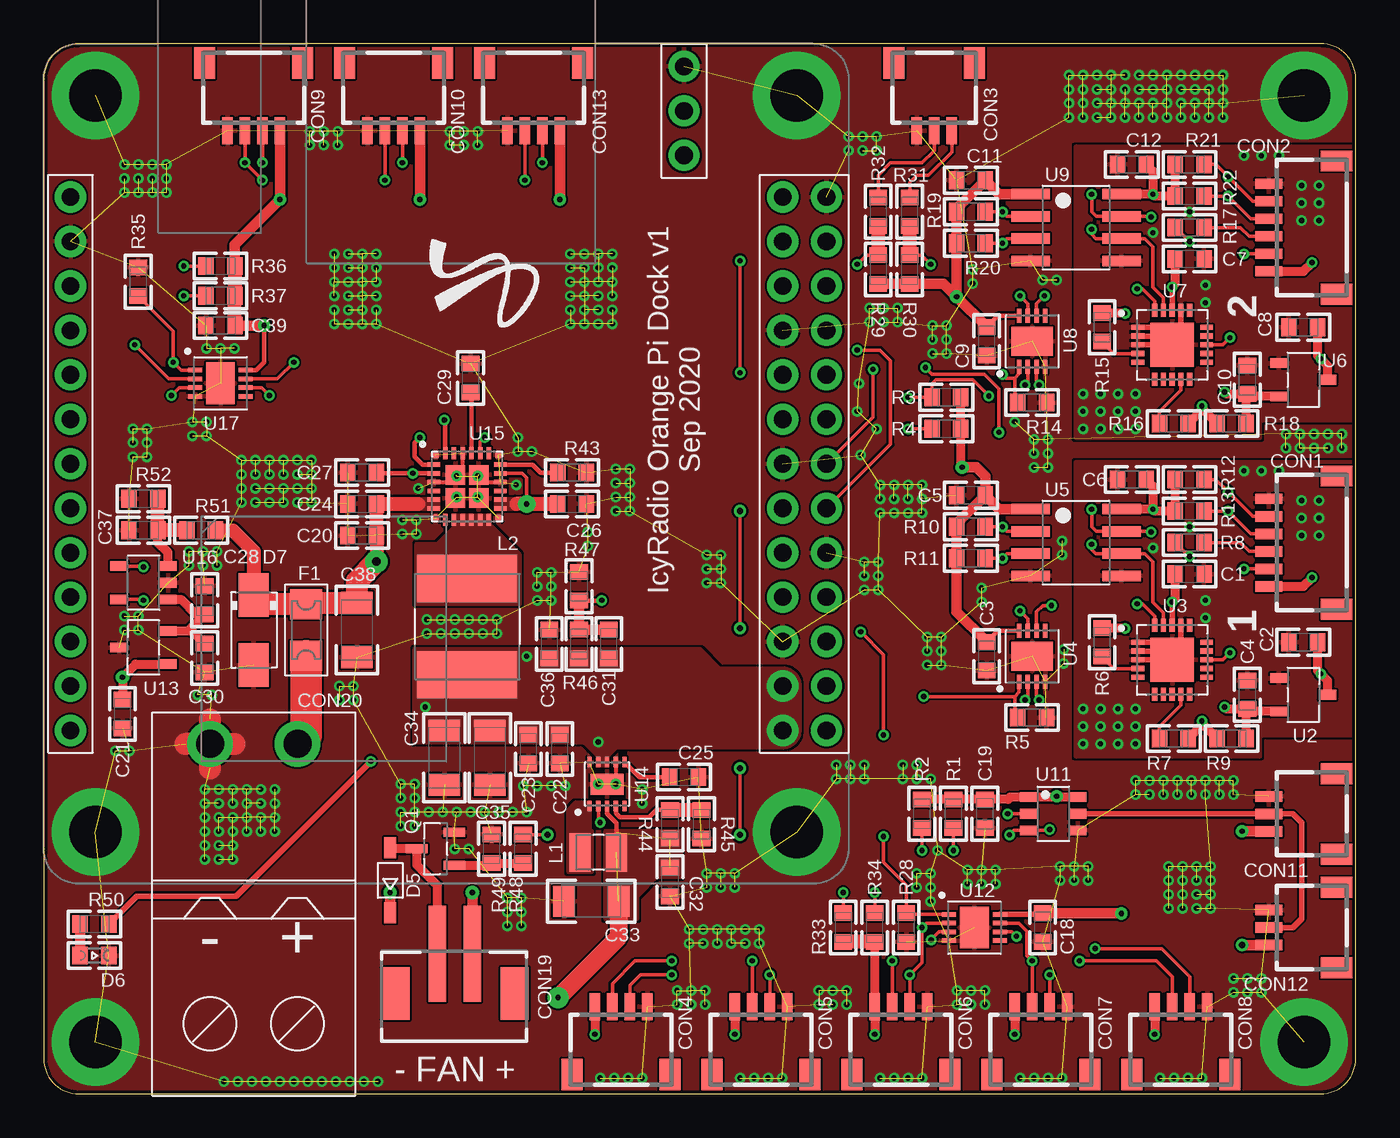
[diagram p5: board, top side]
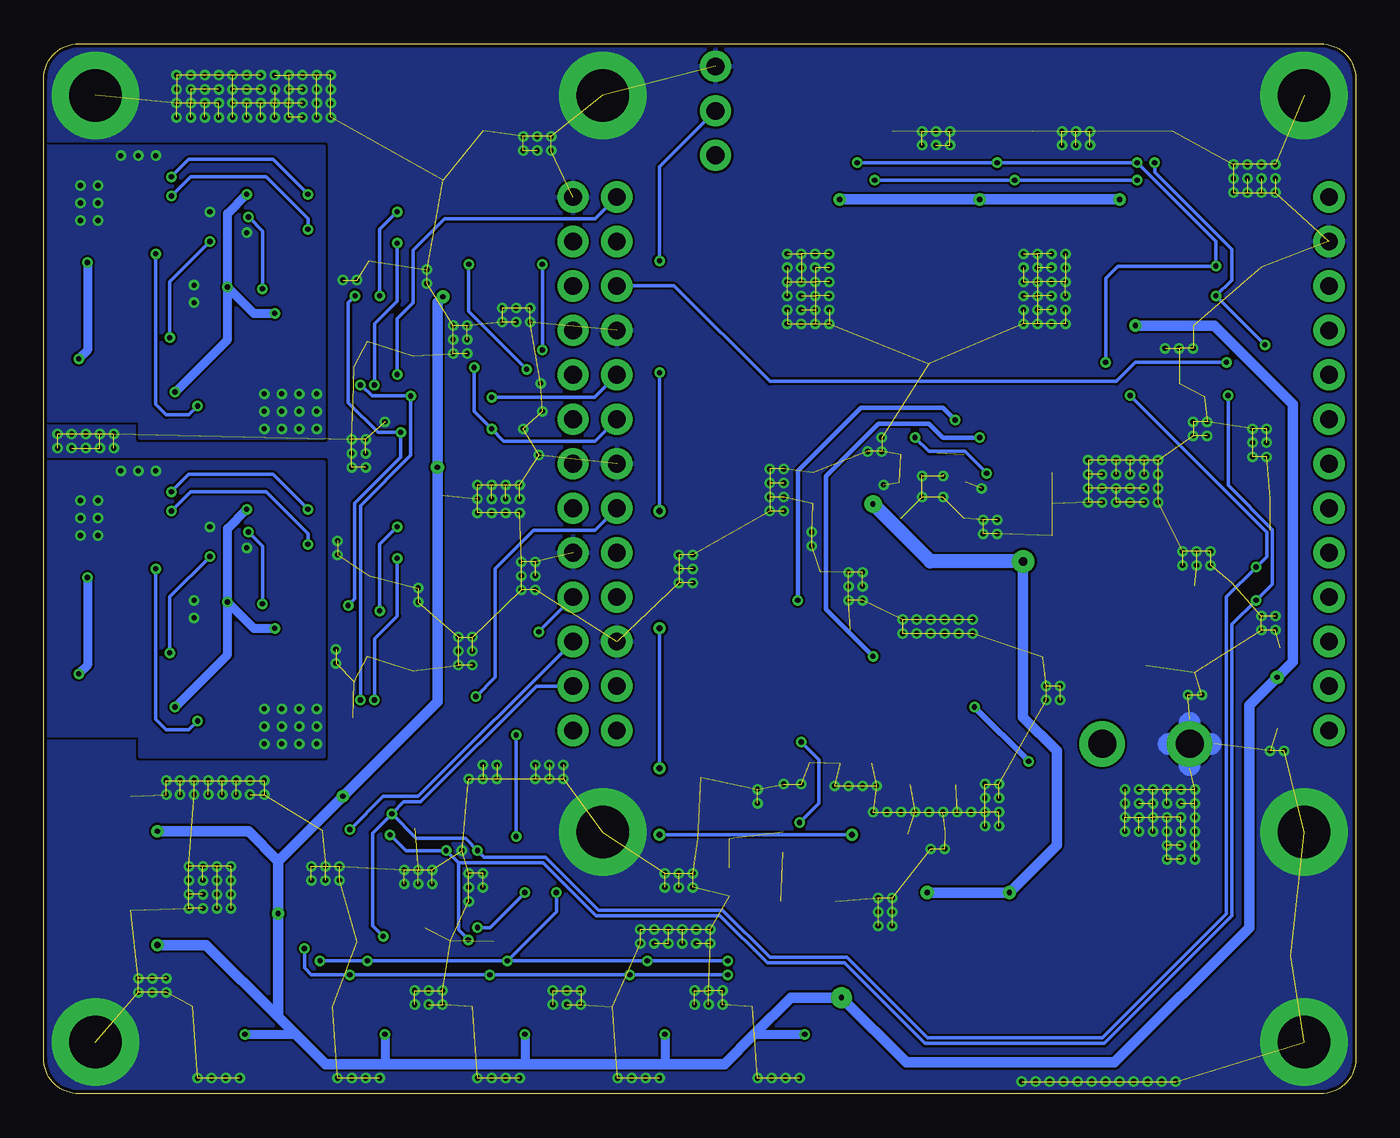
[diagram p6: board, bottom side, seen from below]

Size 75 x 60 mm. Coordinates in mm from the lower left corner, seen from the top.
Outline: 0,58 0,2 arc90 2,0 73,0 arc90 75,2 75,58 arc90 73,60 2,60 arc90 0,58
Copper layers (1*16): Top 0.035mm / dielectric 1.6mm / Bottom 0.035mm
Design rules "jlcpcb_2layer": minimum track width 5mil, minimum drill 0.3mm, track to track 5mil, track to pad 5mil, pad to pad 5mil, via to via 5mil, smd to smd 5mil, copper to edge 0.2mm, drill to drill 5mil, minimum pad ring 3mil, minimum via ring 3mil, stop-mask expansion 0.075mm, vias tented up to drill 10mm, thermal gap 5mil

### Footprints (pad centres in the part's own frame; a part is rotated, then mirrored left to right if it is on the bottom)
CAP0603 = smd 0.889 x 1.016: 1 -0.819,0; 2 0.819,0
CAP1206 = smd 1.27 x 1.778: 1 -1.549,0; 2 1.549,0
SH-06-SIDE = smd 0.6 x 1.55: 1 -2.5,2.975; 2 -1.5,2.975; 3 -0.5,2.975; 4 0.5,2.975; 5 1.5,2.975; 6 2.5,2.975 | smd 1.2 x 1.8: FIT@1 -3.8,-0.9; FIT@2 3.8,-0.9
SH-03-SIDE = smd 0.6 x 1.55: 1 -1,2.975; 2 0,2.975; 3 1,2.975 | smd 1.2 x 1.8: FIT@1 -2.3,-0.9; FIT@2 2.3,-0.9
SH-04-SIDE = smd 0.6 x 1.55: 1 -1.5,2.975; 2 -0.5,2.975; 3 0.5,2.975; 4 1.5,2.975 | smd 1.2 x 1.8: FIT@1 -2.8,-0.9; FIT@2 2.8,-0.9
PH-02-TOP = smd 1 x 5.5: 1 -1,-2; 2 1,-2 | smd 1.6 x 3: P$1 -3.4,0.27; P$2 3.4,0.27
2EDG-2P-5MM = drill 1.6 pad 2.6: P$1 -2.5,0; P$2 2.5,0
SOD-123 = smd 1.2 x 0.7: A 1.85,0; C -1.85,0
0603 = smd 0.889 x 1.016: A 0.819,0; C -0.819,0
DO214AC = smd 2.5 x 1.7: A 2,0; C -2,0
1206 = smd 1.7 x 1.803: 1 -1.472,0; 2 1.472,0
IND2520 = smd 2.2 x 1.2: 1 0,-1.05; 2 0,1.05
IND0606 = smd 2.7 x 5.7: 1 -2.75,0; 2 2.75,0
SOT23 = smd 1.219 x 0.533: 1 -1.067,0.94; 2 -1.067,-0.94; 3 1.067,0
RES0603 = smd 0.889 x 1.016: 1 -0.819,0; 2 0.819,0
ORANGEPIZERO = drill 1.016 pad 1.778: DBG$1 13.601,22.704; DBG$2 13.601,20.162; DBG$3 13.601,17.624; MH$1 21.75,-15.24; MH$2 19.24,-15.24; MH$3 21.75,-12.7; MH$4 19.24,-12.7; MH$5 21.75,-10.16; MH$6 19.24,-10.16; MH$7 21.75,-7.62; MH$8 19.24,-7.62; MH$9 21.75,-5.08; MH$10 19.24,-5.08; MH$11 21.75,-2.54; MH$12 19.24,-2.54; MH$13 21.75,0; MH$14 19.24,0; MH$15 21.75,2.54; MH$16 19.24,2.54; MH$17 21.75,5.08; MH$18 19.24,5.08; MH$19 21.75,7.62; MH$20 19.24,7.62; MH$21 21.75,10.16; MH$22 19.24,10.16; MH$23 21.75,12.7; MH$24 19.24,12.7; MH$25 21.75,15.24; MH$26 19.24,15.24; SH$1 -21.469,15.24; SH$2 -21.469,12.7; SH$3 -21.469,10.16; SH$4 -21.469,7.62; SH$5 -21.469,5.08; SH$6 -21.469,2.54; SH$7 -21.469,0; SH$8 -21.469,-2.54; SH$9 -21.469,-5.08; SH$10 -21.469,-7.62; SH$11 -21.469,-10.16; SH$12 -21.469,-12.7; SH$13 -21.469,-15.24 | drill 3 pad 5: GND@0 -20.055,21.055; GND@1 20.055,21.055; GND@2 20.055,-21.055; GND@3 -20.055,-21.055
SOT23' = smd 1 x 0.55: 1 -1.4,0.95; 2 -1.4,-0.95; 3 1.394,0
QFN20 = smd 0.73 x 0.3: 1 -1.965,1; 2 -1.965,0.5; 3 -1.965,0; 4 -1.965,-0.5; 5 -1.965,-1; 11 1.965,-1; 12 1.965,-0.5; 13 1.965,0; 14 1.965,0.5; 15 1.965,1 | smd 0.3 x 0.73: 6 -1,-1.965; 7 -0.5,-1.965; 8 0,-1.965; 9 0.5,-1.965; 10 1,-1.965; 16 1,1.965; 17 0.5,1.965; 18 0,1.965; 19 -0.5,1.965; 20 -1,1.965 | smd 2.5 x 2.5: PAD 0,0
DFN8 = smd 0.8 x 0.25: 1 -1.45,0.75; 2 -1.45,0.25; 3 -1.45,-0.25; 4 -1.45,-0.75; 5 1.45,-0.75; 6 1.45,-0.25; 7 1.45,0.25; 8 1.45,0.75 | smd 1.65 x 2.38: 9 0,0
SOIC8 = smd 0.6 x 2.2: 1 -1.905,-2.6; 2 -0.635,-2.6; 3 0.635,-2.6; 4 1.905,-2.6; 5 1.905,2.6; 6 0.635,2.6; 7 -0.635,2.6; 8 -1.905,2.6
SOT23-6 = smd 1 x 0.55: 1 -1.4,0.95; 2 -1.4,0; 3 -1.4,-0.95; 4 1.4,-0.95; 5 1.4,0; 6 1.4,0.95
DFN10 = smd 0.6 x 0.25: 1 -1.25,1; 2 -1.25,0.5; 3 -1.25,0; 4 -1.25,-0.5; 5 -1.25,-1; 6 1.25,-1; 7 1.25,-0.5; 8 1.25,0; 9 1.25,0.5; 10 1.25,1 | smd 1.2 x 1.9: 11 0,0
QFN24_CORNER = smd 0.7 x 0.25: 1 -1.9,1.25; 2 -1.9,0.75; 3 -1.9,0.25; 4 -1.9,-0.25; 5 -1.9,-0.75; 6 -1.9,-1.25; 13 1.9,-1.25; 14 1.9,-0.75; 15 1.9,-0.25; 16 1.9,0.25; 17 1.9,0.75; 18 1.9,1.25 | smd 0.25 x 0.7: 7 -1.25,-1.9; 8 -0.75,-1.9; 9 -0.25,-1.9; 10 0.25,-1.9; 11 0.75,-1.9; 12 1.25,-1.9; 19 1.25,1.9; 20 0.75,1.9; 21 0.25,1.9; 22 -0.25,1.9; 23 -0.75,1.9; 24 -1.25,1.9 | smd 1.125 x 1.125: 25 -0.662,0.662; 26 0.662,0.662; 27 -0.662,-0.662; 28 0.662,-0.662 | smd 0.375 x 0.375: 29 -1.812,1.812; 30 1.812,1.812; 31 1.812,-1.812; 32 -1.812,-1.812
SOT23-5 = smd 1 x 0.55: 1 -1.4,0.95; 2 -1.4,0; 3 -1.4,-0.95; 4 1.4,-0.95; 5 1.4,0.95

### Placement (x,y rotation side)
C1  65.5,29.7 0 top
C2  72,25.8 180 top
C3  53.9,25 270 top
C4  68.8,22.8 90 top
C5  53,34.2 180 top
C6  62.2,35.1 180 top
C7  65.5,47.7 0 top
C8  72,43.8 180 top
C9  53.9,43 270 top
C10  68.8,40.8 90 top
C11  53,52.2 180 top
C12  62.2,53.1 180 top
C18  57.1,9.5 270 top
C19  53.8,16 270 top
C20  18.2,31.9 180 top
C21  4.5,21.7 270 top
C22  29.5,19.7 270 top
C23  27.7,19.7 270 top
C24  18.2,33.7 180 top
C25  36.6,18.1 0 top
C26  30.2,33.7 0 top
C27  18.2,35.5 180 top
C28  9.2,28.2 90 top
C29  24.4,40.9 90 top
C30  9.2,24.9 270 top
C31  32.3,25.7 90 top
C32  35.8,12.1 270 top
C33  31.3,11 180 top
C34  22.9,19.2 270 top
C35  25.5,19.2 270 top
C36  28.9,25.7 90 top
C37  5.7,32.2 180 top
C38  17.9,26.5 270 top
C39  10.1,43.9 180 top
CON1  73,31.5 90 top
CON2  73,49.5 90 top
CON3  50.9,58 180 top
CON4  33,2 0 top
CON5  41,2 0 top
CON6  49,2 0 top
CON7  57,2 0 top
CON8  65,2 0 top
CON9  12,58 180 top
CON10  20,58 180 top
CON11  73,16 90 top
CON12  73,9.5 90 top
CON13  28,58 180 top
CON19  23.5,6 180 top
CON20  12,20 0 top
D5  19.8,12.2 90 top
D6  2.9,7.9 180 top
D7  12,26.5 270 top
F1  15,26.5 270 top
L1  31.7,13.8 270 top
L2  24.2,26.7 270 top
LOGO1  21.88,49.03 90 top
Q1  22.4,14 180 top
R1  52,16 90 top
R2  50.2,16 90 top
R3  51.6,39.8 0 top
R4  51.6,38 0 top
R5  56.5,21.5 180 top
R6  60.5,25.8 90 top
R7  64.6,20.3 180 top
R8  65.5,31.5 180 top
R9  67.9,20.3 0 top
R10  53,32.4 180 top
R11  53,30.6 180 top
R12  65.5,35.1 180 top
R13  65.5,33.3 180 top
R14  56.5,39.5 180 top
R15  60.5,43.8 90 top
R16  64.6,38.3 180 top
R17  65.5,49.5 180 top
R18  67.9,38.3 0 top
R19  53,50.4 180 top
R20  53,48.6 180 top
R21  65.5,53.1 180 top
R22  65.5,51.3 180 top
R28  49.3,9.5 90 top
R29  47.7,47.1 270 top
R30  49.5,47.1 270 top
R31  49.5,50.4 270 top
R32  47.7,50.4 270 top
R33  45.7,9.5 270 top
R34  47.5,9.5 270 top
R35  5.4,46.4 270 top
R36  10.1,47.3 0 top
R37  10.1,45.6 0 top
R43  30.2,35.5 180 top
R44  35.8,15.4 270 top
R45  37.6,15.4 90 top
R46  30.6,25.7 270 top
R47  30.6,29 270 top
R48  27.4,14 90 top
R49  25.6,14 270 top
R50  2.9,9.7 0 top
R51  9,32.2 0 top
R52  5.7,34 0 top
U1  23,36 0 top
U2  MCP1703-500  [SOT23']  72,22.8 0 top
U3  64.5,24.8 0 top
U4  56.5,25 90 top
U5  59,31.5 270 top
U6  MCP1703-500  [SOT23']  72,40.8 0 top
U7  64.5,42.8 0 top
U8  56.5,43 90 top
U9  59,49.5 270 top
U11  57.7,16 0 top
U12  53.2,9.5 0 top
U13  REF3030AIDBZ  [SOT23']  5.7,25.5 180 top
U14  32.2,17.7 90 top
U15  24.2,34.7 0 top
U16  5.7,29.2 180 top
U17  10.1,40.6 0 top

### Tracks (layer width: path | path; a pad name or v marks a point on that pad's centre or on a via)
3V0_ADC_CLEAN
  Top 0.508: U13.2 8.27,26.45 | 8.27,26.45 C28.1 8.72,27.38 7.85,28.25 U16.1 | C30.1 8.47,26.45 8.27,26.45
3V3  (via drill 0.3, 0.3 pad 0.7, 0.3 pad 0.75, 0.3 pad 1.2, 0.35 pad 0.7)  (3 unrouted)
  Top 0.254: U4.8 54.53,26.45 C3.1 | U8.8 54.53,44.45 C9.1 | 32.75,14.95 L1.2 32.75,15.45 32.2,16 U14.3 | U17.8 12.15,41.35 12.6,41.8 v12.6,43.9
  Top 0.305: U12.8 57.03,10.25 C18.1
  Top 0.508: U11.6 57.9,16.95 | 57.9,16.95 U11.1 55.25,16.95 55.12,16.82 C19.1 R1.2 R2.2 | CON8.1 v63.5,3.4 | v47.5,3.4 CON6.1 R34.2 | CON7.1 v55.5,3.4 | CON5.1 v39.5,3.4 | CON4.1 v31.5,3.4 | 57.18,10.32 C18.1 | v52.5,35.8 52.42,35.88 R4.2 R3.2 | C21.1 v4.5,23.8 5.25,24.55 U13.1 | v57.9,17 57.9,16.95
  Top 0.61: C9.1 v52.18,45.54 | v52.18,45.54 R20.2 R19.2 52.18,50.56 C11.1 54.61,51.41 U9.1 | C5.1 52.18,32.56 R10.2 R11.2 52.18,27.54 C3.1 | U5.1 54.61,33.41 C5.1 | C5.1 53.82,35.28 53.3,35.8 v52.5,35.8 | v52.18,45.54 51.44,46.28 R30.2 R29.2 | v68.5,8.5 CON12.1 | v68.5,15 CON11.1 | C18.1 61.58,10.32 v61.6,10.3 | CON9.1 v13.5,51.1 10.92,48.52 R36.2 | CON10.1 v21.5,51.1 | v29.5,51.1 CON13.1 | v12.6,43.9 C39.1
  Top 0.813: R36.2 R37.2 C39.1 | R34.2 R33.2
  Top 1.016: C33.1 32.85,8.95 v29.4,5.5
  Bottom 0.508: v47.5,3.4 47.5,1.7 | v55.5,3.4 55.5,1.7 | v39.5,3.4 39.5,1.7 | 34.4,3.4 v31.5,3.4 | v63.5,3.4 60.6,3.4
  Bottom 0.61: 61.6,13.3 v57.9,17 52.5,22.4 v52.5,35.8 52.5,45.22 v52.18,45.54 | 61.6,4.4 60.6,3.4 58.9,1.7 55.5,1.7 47.5,1.7 39.5,1.7 36.1,1.7 34.4,3.4 32.3,5.5 v29.4,5.5 25.7,1.8 13.8,1.8 6.1,9.5 6.1,22.2 v4.5,23.8 3.6,24.7 3.6,39.4 8.1,43.9 v12.6,43.9 | 61.6,4.4 v61.6,10.3 61.6,13.3 | v68.5,8.5 65.7,8.5 61.6,4.4 | 61.6,13.3 63.3,15 v68.5,15 | v29.5,51.1 v21.5,51.1 v13.5,51.1
  pour Top (no thermals): 32.1,15 36.4,15 36.4,12.4 35,12.4 33.9,11.3 33.9,10 32.1,10
3V3_FB
  Top 0.254: U14.4 32.7,16.04 32.94,15.8 34.6,15.8 35.02,16.22 R44.1
  Top 0.813: R44.1 R45.2
3V3_SOFTSTART
  Top 0.254: U14.6 34.05,18.1 C25.1
3V3_SW
  pour Top (no thermals): 30.4,16.62 30,16.2 30,12.7 31.3,12.7 31.3,15 31.2,15.1 31.2,16.62
5V0  (via drill 0.3)
  Top 0.2: v31.8,15.5 31.7,15.6 U14.2
  Top 0.254: U15.1 21.65,35.95 21.2,36.4 21.2,37.2 v21.5,37.5
  Top 0.305: v18.7,19 11,11.3 5.32,11.3 R50.2
  Bottom 0.2: v31.8,15.5 30.7,16.6 30.7,19.1 v31.7,20.1
  Bottom 0.254: v21.5,37.5 23.6,37.5 24.4,38.3 27.3,38.3 30.3,35.3 30.3,27.7 v27.6,25
  Bottom 0.305: v21.8,22.1 v18.7,19
  pour Top (no thermals): 21.2,25.4 37.5,25.4 38.6,24.3 42.2,24.3 arc-90 43.2,23.3 43.2,20.8 arc-90 42.2,19.8 32.7,19.8 32.2,19.3 32.2,18.77 31.7,18.77 31.7,19.3 30.9,20.1 21.2,20.1
5V0_FB  (via drill 0.3)
  Top 0.254: R47.2 31.88,28.18 v31.9,28.2 | v22.9,38.5 22.95,38.45 U15.24
  Top 0.61: R47.2 R46.1 C31.2
  Bottom 0.254: v31.9,28.2 31.9,35.6 28.3,39.2 23.6,39.2 v22.9,38.5
5V0_INTVCC  (via drill 0.3)
  Top 0.2: U15.20 24.95,37.25 v25.2,37.5
  Top 0.254: U15.2 v21.1,35.45 19.07,35.45 C27.1
  Bottom 0.2: v25.2,37.5 24.4,36.7 22.35,36.7 v21.1,35.45
5V0_RT
  Top 0.254: U15.18 27.95,35.95 28.4,35.5 R43.2
5V0_SS
  Top 0.254: C29.1 24.45,40.08 U15.21
5V0_SW
  pour Top (no thermals): 23.45,33.02 23.45,32.35 22.5,31.4 21.3,31.4 21.3,28 27.2,28 27.2,30.8 25.45,32.55 25.45,33.02
5V0SB_PSU1  (via drill 0.3)
  Top 0.305: U3.18 v64.5,28.1
  Top 0.508: U2.2 68.93,21.85 C4.1 | C4.1 68.72,21.9 R9.2 | C4.1 67.62,21.98 v67.5,22.1 | v64.5,28.1 64.68,28.28 C1.1 | v63.4,33.4 v63.4,33.41 U5.8 | C6.1 63.4,34.72 v63.4,33.4 | v63.4,33.4 63.5,33.3 R13.2 R12.2 | v61.8,26.6 60.52,26.6 R6.2
  Bottom 0.508: v67.5,22.1 64.5,25.1 v64.5,28.1 | v64.5,28.1 64.5,32.3 v63.4,33.4 | v64.5,28.1 63,26.6 v61.8,26.6
5V0SB_PSU2  (via drill 0.3)
  Top 0.305: U7.18 v64.5,46.1
  Top 0.508: U6.2 68.93,39.85 C10.1 | C10.1 68.72,39.9 R18.2 | C10.1 67.62,39.98 v67.5,40.1 | v64.5,46.1 64.68,46.28 C7.1 | v63.4,51.4 v63.4,51.41 U9.8 | C12.1 63.4,52.72 v63.4,51.4 | v63.4,51.4 63.5,51.3 R22.2 R21.2 | v61.8,44.6 60.52,44.6 R15.2
  Bottom 0.508: v67.5,40.1 64.5,43.1 v64.5,46.1 | v64.5,46.1 64.5,50.3 v63.4,51.4 | v64.5,46.1 63,44.6 v61.8,44.6
12V0SB_PSU1  (via drill 0.3)
  Top 0.508: CON1.1 72,29 v72.5,29.5 | C2.1 72.82,24.18 v73,24 73.39,23.61 U2.3
  Bottom 0.508: v72.5,29.5 72.5,24.5 v73,24
12V0SB_PSU2  (via drill 0.3)
  Top 0.508: CON2.1 72,47 v72.5,47.5 | C8.1 72.82,42.18 v73,42 73.39,41.61 U6.3
  Bottom 0.508: v72.5,47.5 72.5,42.5 v73,42
!ENABLE_PSU1
  Top 0.2: R8.1 68.4,31.5 68.9,31 CON1.3
!ENABLE_PSU2
  Top 0.2: R17.1 68.4,49.5 68.9,49 CON2.3
!PRESENT_PSU1  (via drill 0.3)
  Top 0.2: v68.6,30 CON1.2
  Top 0.508: R7.1 66.2,21.08 v66.2,21.3 66.2,21.18 R9.1
  Bottom 0.2: v66.2,21.3 66.7,20.8 68,20.8 68.6,21.4 v68.6,30
!PRESENT_PSU2  (via drill 0.3)
  Top 0.2: v68.6,48 CON2.2
  Top 0.508: R16.1 66.2,39.08 v66.2,39.3 66.2,39.18 R18.1
  Bottom 0.2: v66.2,39.3 66.7,38.8 68,38.8 68.6,39.4 v68.6,48
EXT_I2C_EN0  (via drill 0.3)
  Top 0.2: v48,14.7 48,13.22 49.3,11.92 R28.2 49.37,10.25 U12.1 | v48,20.5 48,25.1 v46.7,26.4
  Bottom 0.2: v48,14.7 v48,20.5 | v46.7,26.4 46.7,26.43 U1.MH$7
EXT_I2C_EN1  (via drill 0.3)
  Top 0.2: U17.1 7.85,41.35 v7.4,41.8 7.4,43.58 R35.2
  Bottom 0.2: v7.4,41.8 12.6,41.8 13.7,40.7 33.5,40.7 38.96,46.16 U1.MH$22
FAN_PWM  (via drill 0.3, 0.35)
  Top 0.2: v39.8,33.3 v39.8,26.6 | v39.8,18.6 v39.8,14.8 | v28.8,14.8 27.42,14.8 R48.2 | v39.8,47.6 v39.8,41.2
  Bottom 0.2: v39.8,26.6 v39.8,18.6 | v39.8,41.2 v39.8,33.3 | v39.8,47.6 39.8,52.96 U1.DBG$2 | v28.8,14.8 v39.8,14.8
GND  (via drill 0.3, 3 pad 5)  (577 unrouted)
  Top 0.2: U15.3 23.25,34.95 v23.6,35.3 23.95,35.65 U15.22 | U15.16 25.15,34.95 v24.8,35.3 | U14.7 32.7,18.2 U14.11
  Top 1.27: CON20.P$1 10.9,20 | CON20.P$1 9.5,21.4 | CON20.P$1 8.1,20 | 9.5,18.6 CON20.P$1
  Bottom 1.27: CON20.P$1 10.7,20 | 9.5,18.8 CON20.P$1 | CON20.P$1 8.3,20 | CON20.P$1 9.5,21.2
  other vias: 27,34.8 21.4,34.6 23.6,34.1 24.8,34.1 55.5,38.4 51.1,13.9 32.7,17.7 31.7,17.7 72.06,57.05 72.06,2.94 2.94,2.94 64.3,13 65.1,13 65.1,12.2 64.3,12.2 64.3,11.4 65.1,11.4 65.1,10.6 64.3,10.6 65.9,11.4 66.7,11.4 66.7,10.6 65.9,10.6 65.9,13 66.7,13 66.7,12.2 65.9,12.2 62.4,17.9 63.2,17.9 63.2,17.1 62.4,17.1 64,17.9 64.8,17.9 64.8,17.1 64,17.1 65.6,17.9 66.4,17.9 66.4,17.1 65.6,17.1 67.2,17.9 68,17.9 68,17.1 67.2,17.1 58.1,13 58.1,12.2 58.9,13 59.7,13 59.7,12.2 58.9,12.2 36.2,5.9 36.2,5.1 37,5.9 37.8,5.9 37.8,5.1 37,5.1 44.3,5.9 44.3,5.1 45.1,5.9 45.9,5.9 45.9,5.1 45.1,5.1 11.6,15.8 11.6,15 12.4,15.8 13.2,15.8 13.2,15 12.4,15 11.6,17.4 11.6,16.6 12.4,17.4 13.2,17.4 13.2,16.6 12.4,16.6 9.2,17.4 9.2,16.6 10,17.4 10.8,17.4 10.8,16.6 10,16.6 9.2,15.8 9.2,15 10,15.8 10.8,15.8 10.8,15 10,15 9.2,14.2 9.2,13.4 10,14.2 10.8,14.2 10.8,13.4 10,13.4 65.8,56.6 65.8,55.8 66.6,56.6 67.4,56.6 67.4,55.8 66.6,55.8 65.8,58.2 65.8,57.4 66.6,58.2 67.4,58.2 67.4,57.4 66.6,57.4 63.4,58.2 63.4,57.4 64.2,58.2 65,58.2 65,57.4 64.2,57.4 63.4,56.6 63.4,55.8 64.2,56.6 65,56.6 65,55.8 64.2,55.8 61,56.6 61,55.8 61.8,56.6 62.6,56.6 62.6,55.8 61.8,55.8 61,58.2 61,57.4 61.8,58.2 62.6,58.2 62.6,57.4 61.8,57.4 58.6,58.2 58.6,57.4 59.4,58.2 60.2,58.2 60.2,57.4 59.4,57.4 58.6,56.6 58.6,55.8 59.4,56.6 60.2,56.6 60.2,55.8 59.4,55.8 18.2,46.4 19,46.4 18.2,47.2 18.2,48 19,48 19,47.2 16.6,46.4 17.4,46.4 16.6,47.2 16.6,48 17.4,48 17.4,47.2 16.6,44 17.4,44 16.6,44.8 16.6,45.6 17.4,45.6 17.4,44.8 18.2,44 19,44 18.2,44.8 18.2,45.6 19,45.6 19,44.8 13.7,34.6 13.7,33.8 14.5,34.6 15.3,34.6 15.3,33.8 14.5,33.8 13.7,36.2 13.7,35.4 14.5,36.2 15.3,36.2 15.3,35.4 14.5,35.4 11.3,36.2 11.3,35.4 12.1,36.2 12.9,36.2 12.9,35.4 12.1,35.4 11.3,34.6 11.3,33.8 12.1,34.6 12.9,34.6 12.9,33.8 12.1,33.8 31.7,46.4 32.5,46.4 31.7,47.2 31.7,48 32.5,48 32.5,47.2 30.1,46.4 30.9,46.4 30.1,47.2 30.1,48 30.9,48 30.9,47.2 30.1,44 30.9,44 30.1,44.8 30.1,45.6 30.9,45.6 30.9,44.8 31.7,44 32.5,44 31.7,44.8 31.7,45.6 32.5,45.6 32.5,44.8 31.8,0.9 32.6,0.9 33.4,0.9 34.2,0.9 39.8,0.9 40.6,0.9 41.4,0.9 42.2,0.9 47.8,0.9 48.6,0.9 49.4,0.9 50.2,0.9 55.8,0.9 56.6,0.9 57.4,0.9 58.2,0.9 29,17.6 29.8,17.6 27.4,17.6 28.2,17.6 22,16.1 22.8,16.1 26,16.1 25.2,16.1 20.4,16.1 21.2,16.1 21.2,15.3 20.4,15.3 20.4,17.7 21.2,17.7 21.2,16.9 20.4,16.9 23.6,16.1 24.4,16.1 27.6,16.1 26.8,16.1 39.5,11.8 39.5,12.6 37.9,11.8 37.9,12.6 38.7,12.6 38.7,11.8 27.3,11.2 26.5,11.2 27.3,9.6 26.5,9.6 26.5,10.4 27.3,10.4 28.2,28.2 29,28.2 28.2,29.8 29,29.8 29,29 28.2,29 49.4,33.2 50.2,33.2 49.4,34.8 50.2,34.8 50.2,34 49.4,34 47.8,33.2 48.6,33.2 47.8,34.8 48.6,34.8 48.6,34 47.8,34 56.6,35.8 57.4,35.8 56.6,37.4 57.4,37.4 57.4,36.6 56.6,36.6 48.8,44.1 48.8,44.9 47.2,44.1 47.2,44.9 48,44.9 48,44.1 50.8,42.3 51.6,42.3 50.8,43.9 51.6,43.9 51.6,43.1 50.8,43.1 24.8,54.2 24.8,55 23.2,54.2 23.2,55 24,55 24,54.2 16.8,54.2 16.8,55 15.2,54.2 15.2,55 16,55 16,54.2 6.2,51.5 7,51.5 6.2,53.1 7,53.1 7,52.3 6.2,52.3 4.6,51.5 5.4,51.5 4.6,53.1 5.4,53.1 5.4,52.3 4.6,52.3 5.1,36.4 5.9,36.4 5.1,38 5.9,38 5.9,37.2 5.1,37.2 9.9,30.2 9.9,31 8.3,30.2 8.3,31 9.1,31 9.1,30.2 5.4,26.5 5.4,27.3 4.6,27.3 4.6,26.5 17.7,22.5 17.7,23.3 16.9,23.3 16.9,22.5 25.9,26.3 25.9,27.1 25.1,27.1 25.1,26.3 24.3,26.3 24.3,27.1 23.5,27.1 23.5,26.3 22.7,26.3 22.7,27.1 21.9,27.1 21.9,26.3 21.3,32 21.3,32.8 20.5,32.8 20.5,32 33.5,34.9 33.5,35.7 32.7,35.7 32.7,34.9 33.5,33.3 33.5,34.1 32.7,34.1 32.7,33.3 40.9,8.6 40.9,9.4 39.3,8.6 39.3,9.4 40.1,9.4 40.1,8.6 38.5,8.6 38.5,9.4 36.9,8.6 36.9,9.4 37.7,9.4 37.7,8.6 54.4,12 54.4,12.8 52.8,12 52.8,12.8 53.6,12.8 53.6,12 50.7,12.6 49.9,12.6 50.7,11 49.9,11.8 50.7,11.8 71.8,36.9 71.8,37.7 71,37.7 71,36.9 74.2,36.9 74.2,37.7 72.6,36.9 72.6,37.7 73.4,37.7 73.4,36.9 27.1,37.5 27.1,36.7 27.9,36.7 47.6,53.9 47.6,54.7 46,53.9 46,54.7 46.8,54.7 46.8,53.9 49.9,18 50.7,18 46.9,18 46.9,18.8 45.3,18 45.3,18.8 46.1,18.8 46.1,18 49.1,18 49.1,18.8 49.9,18.8 52.2,5.9 52.2,5.1 53,5.9 53.8,5.9 53.8,5.1 53,5.1 63.8,0.9 64.6,0.9 65.4,0.9 66.2,0.9 31.1,32.1 31.1,31.3 57.9,46.5 57.1,46.5 53.1,47.1 53.1,46.3 53.6,28.9 53.6,28.1 58.2,31.6 58.2,30.8 58.3,25.4 58.3,24.6 50.5,24.5 51.3,24.5 50.5,26.1 51.3,26.1 51.3,25.3 50.5,25.3 37.9,29.2 38.7,29.2 37.9,30.8 38.7,30.8 38.7,30 37.9,30 8.5,38.4 9.3,38.4 9.3,37.6 8.5,37.6 9.3,42.6 10.1,42.6 10.9,42.6 68,5.8 68.8,5.8 69.6,5.8 68,6.6 68.8,6.6 69.6,6.6 34.2,16.6 34.2,17.4 8.8,22.8 9.6,22.8 4.1,19.6 4.9,19.6 17.5,0.7 18.3,0.7 19.1,0.7 15.1,0.7 15.9,0.7 16.7,0.7 12.7,0.7 13.5,0.7 14.3,0.7 10.3,0.7 11.1,0.7 11.9,0.7 46.9,28.8 47.7,28.8 46.9,30.4 47.7,30.4 47.7,29.6 46.9,29.6 47.6,38 46.7,36.5 46.5,39 46.6,40.6 23.5,14 24.3,14
  pour Top (rank 6): -1,61 76,61 76,-1 -1,-1
  pour Bottom (rank 6): -2,62 77,62 77,-2 -2,-2
GND_PSU1  (via drill 0.3)
  Top 0.305: U3.17 65,24.8 U3.PAD | U3.3 U3.PAD | U3.2 64.5,25.3 U3.PAD | U3.1 64.5,25.8 U3.PAD
  other vias: 59.4,20 59.4,21 59.4,22 60.4,22 60.4,21 60.4,20 71.9,31.9 71.9,32.9 71.9,33.9 72.9,33.9 72.9,32.9 72.9,31.9 70.6,35.6 69.6,35.6 68.6,35.6 66.4,28.2 66.4,27.2 63.4,31.2 65.5,32.4 61.4,20 61.4,21 61.4,22 62.4,22 62.4,21 62.4,20
  pour Top: 76,20.5 76,36.1 59,36.1 59,19.3 69.5,19.3 69.5,20.5
  pour Bottom: 76,20.5 76,36.1 59,36.1 59,19.3 69.5,19.3 69.5,20.5
GND_PSU2  (via drill 0.3)
  Top 0.305: U7.17 65,42.8 | U7.3 U7.PAD 64.5,43.3 U7.2 | U7.1 64.5,43.8
  other vias: 59.4,38 59.4,39 59.4,40 60.4,40 60.4,39 60.4,38 71.9,49.9 71.9,50.9 71.9,51.9 72.9,51.9 72.9,50.9 72.9,49.9 70.6,53.6 69.6,53.6 68.6,53.6 66.4,46.2 66.4,45.2 63.4,49.2 65.5,50.4 61.4,38 61.4,39 61.4,40 62.4,40 62.4,39 62.4,38
  pour Top: 76,38.5 76,54.1 59,54.1 59,37.5 69.5,37.5 69.5,38.5
  pour Bottom: 76,38.5 76,54.1 59,54.1 59,37.5 69.5,37.5 69.5,38.5
I2C0_SCL  (via drill 0.3)
  Top 0.2: 51.45,9.25 U12.3 51.18,9.25 v50.73,8.8 | v52,13.9 R1.1 | v55.2,14.8 55.45,15.05 U11.3 57.45,15.05 v57.5,15.1 | v5.7,28.2 5.65,28.25 U16.5 | v7.3,39.9 7.75,40.35 U17.3
  Bottom 0.2: 51.3,13.2 v52,13.9 54.3,13.9 v55.2,14.8 | v50.73,8.8 51.3,9.37 51.3,13.2 | v57.5,15.1 55.6,17 53.59,17 U1.MH$5 | 51.3,13.2 46.46,13.2 43.44,10.17 36.34,10.17 33.63,7.47 29.23,7.47 24.64,2.87 14.37,2.87 7.07,10.16 7.07,26.83 v5.7,28.2 4.77,29.13 4.77,32.23 7.3,34.76 v7.3,39.9
I2C0_SDA  (via drill 0.3)
  Top 0.2: U12.6 55.35,9.25 v55.6,9 | v50.2,13.9 R2.1 | U11.2 v55.1,16 | U16.4 5.65,30.15 v5.7,30.1 | v12.9,39.9 12.45,40.35 U17.6
  Bottom 0.2: v55.6,9 56.2,9.6 56.2,14.9 v55.1,16 | 45.05,23.3 U1.MH$3 46.83,23.3 53.45,16.67 54.43,16.67 v55.1,16 | v55.1,16 53.7,14.6 50.9,14.6 v50.2,13.9 49.83,13.53 46.33,13.53 43.3,10.5 36.2,10.5 33.5,7.8 29.1,7.8 24.5,3.2 14.5,3.2 7.4,10.3 7.4,28.4 v5.7,30.1 5.1,30.7 5.1,32.1 v12.9,39.9
I2C1_SCL  (via drill 0.3)
  Top 0.2: v49.4,39.8 R3.1 50.78,40.58 51,40.8 53.1,40.8 v54.03,39.87 | U8.3 56.75,40.65 v56.9,40.5 | U4.3 56.75,22.65 v56.9,22.5
  Bottom 0.2: U1.MH$18 43.52,39.8 v49.4,39.8 | v56.9,40.5 56.84,40.5 56.22,39.87 v54.03,39.87 54.03,36.47 56.9,33.6 v56.9,22.5
I2C1_SDA  (via drill 0.3)
  Top 0.2: v49.4,38 R4.1 | U8.6 56.75,45.15 v57.2,45.6 | v54.6,37.8 54.6,40.3 53.77,41.13 50.77,41.13 v50.4,41.5 | U4.6 56.75,27.55 57.1,27.9 v57.6,27.9
  Bottom 0.2: U1.MH$16 43.48,37.3 48.7,37.3 v49.4,38 50.4,39 v50.4,41.5 | v57.2,45.6 57.6,45.2 57.6,39.5 55.9,37.8 v54.6,37.8 54.6,36.36 57.23,33.73 57.23,28.27 v57.6,27.9
I2C_SCL_EXT0  (via drill 0.3)
  Top 0.2: CON4.3 33.5,6.2 34.1,6.8 v35.9,6.8 | CON5.3 v41.5,6.8 | CON6.3 v49.5,6.8 50.2,7.5 v50.2,9.5 50.45,9.75 U12.2 | CON7.3 v57.5,6.8 | v47.5,11.5 R34.1 | v60.1,8.3 63.9,8.3 65.5,6.7 CON8.3
  Bottom 0.2: v35.9,6.8 v41.5,6.8 v49.5,6.8 v57.5,6.8 59.7,6.8 60.1,7.2 v60.1,8.3 | v50.2,9.5 49.5,9.5 v47.5,11.5
I2C_SCL_EXT1  (via drill 0.3)
  Top 0.2: U17.2 7.15,40.85 v5.2,42.8 | v8,45.6 R37.1 | CON9.3 v11.5,53.2 v12.5,52.2 | v27.5,52.2 CON13.3 | CON10.3 v19.5,52.2
  Bottom 0.2: v5.2,42.8 v8,45.6 7.1,46.5 7.1,48.26 11.5,52.66 v11.5,53.2 | v12.5,52.2 v19.5,52.2 v27.5,52.2
I2C_SCL_PSU1  (via drill 0.3)
  Top 0.2: CON1.4 69,32 v67.7,33.3 R13.1 | v59.9,31.4 59.9,31.1 60.13,30.86 U5.6 62.94,30.86 63.4,30.4 63.4,28.1 64,27.5 U3.19
  Bottom 0.2: v59.9,31.4 59.9,32 62.3,34.4 66.6,34.4 v67.7,33.3
I2C_SCL_PSU2  (via drill 0.3)
  Top 0.2: CON2.4 69,50 v67.7,51.3 R22.1 | v59.9,49.4 59.9,49.1 60.13,48.87 U9.6 62.94,48.87 63.4,48.4 63.4,46.1 64,45.5 U7.19
  Bottom 0.2: v59.9,49.4 59.9,50 62.3,52.4 66.6,52.4 v67.7,51.3
I2C_SDA_EXT0  (via drill 0.3)
  Top 0.2: CON4.2 32.5,6.3 33.8,7.6 v35.9,7.6 | CON5.2 v40.5,7.6 | CON6.2 v48.5,7.6 | CON7.2 v56.5,7.6 56.2,7.9 56.2,9.3 55.75,9.75 U12.7 | v45.7,11.5 R33.1 | v59.2,7.6 63.6,7.6 64.5,6.7 CON8.2
  Bottom 0.2: v59.2,7.6 v56.5,7.6 v48.5,7.6 | v48.5,7.6 v40.5,7.6 v35.9,7.6 | v48.5,7.6 45.7,10.4 v45.7,11.5
I2C_SDA_EXT1  (via drill 0.3)
  Top 0.2: U17.7 13.35,40.85 v14.3,41.8 | v8,47.3 R36.1 | v12.5,53.2 CON9.2 | v28.5,53.2 CON13.2 | CON10.2 v20.5,53.2
  Bottom 0.2: v14.3,41.8 14.3,46.6 13.6,47.3 v8,47.3 8,48.7 v12.5,53.2 v20.5,53.2 v28.5,53.2
I2C_SDA_PSU1  (via drill 0.3)
  Top 0.2: CON1.5 69.1,33 v67.7,34.4 67,35.1 R12.1 | v59.9,33.4 59.9,32.4 60.16,32.13 U5.7 63.27,32.13 v63.3,32.1 | U3.20 63.5,27.3 62.8,28 v62.5,28
  Bottom 0.2: v59.9,33.4 61.9,35.4 66.7,35.4 v67.7,34.4 | v62.5,28 62.5,31.3 v63.3,32.1
I2C_SDA_PSU2  (via drill 0.3)
  Top 0.2: CON2.5 69.1,51 v67.7,52.4 67,53.1 R21.1 | v59.9,51.4 59.9,50.4 60.16,50.13 U9.7 63.27,50.13 v63.3,50.1 | U7.20 63.5,45.3 62.8,46 v62.5,46
  Bottom 0.2: v59.9,51.4 61.9,53.4 66.7,53.4 v67.7,52.4 | v62.5,46 62.5,49.3 v63.3,50.1
LOWER_OPEN  (via drill 0.3)
  Top 0.2: U1.MH$11 48.4,37.11 48.4,41.9 47.8,42.5 v46.5,42.5 | v46.5,47.4 47.02,47.92 R29.1
  Top 0.813: R29.1 R32.2
  Bottom 0.2: v46.5,42.5 v46.5,47.4
N$1  (via drill 0.3)
  Top 0.2: U5.3 55.06,30.86 v54.8,30.6 R11.1 | v56.1,22.5 56.25,22.65 U4.2
  Bottom 0.2: v56.1,22.5 56.1,26 54.8,27.3 v54.8,30.6
N$2  (via drill 0.3)
  Top 0.2: U4.7 56.25,27.15 v55.8,27.6 | U5.2 55.06,32.13 v54.8,32.4 R10.1
  Bottom 0.2: v55.8,27.6 55.8,31.4 v54.8,32.4
N$3
  Top 0.2: U3.4 61.18,24.3 R6.1
N$4  (via drill 0.3)
  Top 0.2: U3.13 67.4,24.8 v67.8,25.2 | v65.5,30.7 65.48,30.7 R8.2
  Bottom 0.2: v67.8,25.2 67.8,28.4 v65.5,30.7
N$5
  Top 0.2: U3.9 65,22.2 63.78,20.98 R7.2
N$6  (via drill 0.3)
  Top 0.2: U8.2 56.25,40.65 v56.1,40.5 | U9.3 55.06,48.87 v54.8,48.6 R20.1
  Bottom 0.2: v56.1,40.5 56.1,44 54.8,45.3 v54.8,48.6
N$7  (via drill 0.3)
  Top 0.2: U8.7 56.25,45.15 v55.8,45.6 | R19.1 v54.8,50.4 55.06,50.13 U9.2
  Bottom 0.2: v55.8,45.6 55.8,49.4 v54.8,50.4
N$8
  Top 0.2: U7.4 61.18,42.3 R15.1
N$9  (via drill 0.3)
  Top 0.2: U7.13 67.4,42.8 v67.8,43.2 | v65.5,48.7 65.48,48.7 R17.2
  Bottom 0.2: v67.8,43.2 67.8,46.4 v65.5,48.7
N$10
  Top 0.2: U7.9 65,40.2 63.78,38.98 R16.2
N$19
  Top 1.8: 15,20.46 F1.2 15,20.5 CON20.P$2
N$26
  Top 0.2: R32.1 47.7,52.5 48.4,53.2 50.2,53.2 50.9,53.9 CON3.2
N$27
  Top 0.2: R31.1 49.5,52.07 49.9,52.47 50.57,52.47 51.9,53.8 CON3.1
N$34
  Top 0.508: CON19.2 22.5,11.9 21.33,13.07 Q1.3 19.85,14 D5.A
N$35
  Top 0.508: Q1.1 25.48,13.06 R49.2 R48.1
N$149
  Top 0.61: D6.A R50.1
OW_BUS
  Top 0.305: U11.5 CON11.2 71.4,16 71.9,15.5 71.9,10 71.4,9.5 CON12.2
PSU1_I2C_EN  (via drill 0.3)
  Top 0.2: U4.1 55.75,22.95 55.5,22.7 | 55.5,22.7 55.5,21.68 R5.2 | 55.5,22.7 v50.3,22.7
  Bottom 0.2: v50.3,22.7 49.2,23.8 49.2,30 47,32.2 43.5,32.2 U1.MH$12
PSU2_I2C_EN  (via drill 0.3)
  Top 0.2: U8.1 55.75,41.15 55.5,40.9 | 55.5,40.9 55.5,39.68 R14.2 | 55.5,40.9 55,40.9 v54.8,41.1
  Bottom 0.2: v54.8,41.1 54.8,44.3 53.9,45.2 53.9,48.2 52.1,50 43.48,50 U1.MH$26
UPPER_OPEN  (via drill 0.3)
  Top 0.2: U1.MH$13 47.4,38.65 v47.4,41.4 | v50.7,47.4 50.18,47.92 R30.1
  Top 0.813: R30.1 R31.2
  Bottom 0.2: v47.4,41.4 50.7,44.7 v50.7,47.4
VIN  (via drill 0.3 pad 0.75, 0.3 pad 1, 0.5 pad 1.3)
  Top 0.2: U15.17 27.35,35.45 27.6,35.2 v27.6,33.7
  Top 0.508: 9.82,32.08 R51.2
  Top 0.61: v19.8,11.5 D5.C | v24.5,11.5 CON19.1
  Top 0.813: v19.02,30.42 C20.1 C24.1 21.4,33.7 | C26.1 v27.6,33.7 27,33.7 | R51.2 10.8,32.2 12,31 D7.C
  Top 1.27: v19.02,30.42 17.9,29.3 C38.1 15.08,28.05 F1.1 12.53,27.97 D7.C
  Bottom 0.61: v19.02,30.42 19.02,21.52 17.1,19.6 17.1,14.2 v19.8,11.5 v24.5,11.5
  Bottom 0.813: v19.02,30.42 24.32,30.42 v27.6,33.7
  pour Top (no thermals): 22.53,33.98 21.3,33.98 21.3,33.42 22.53,33.42
  pour Top (no thermals): 25.87,33.42 27.1,33.42 27.1,33.98 25.87,33.98
VIN_VSENSE
  Top 0.508: U16.3 7.1,30.92 6.52,31.5 C37.1
  Top 0.813: R52.2 C37.1 R51.1

### Text on the board
tPlace: 2 | IcyRadio Orange Pi Dock v1 / Sep 2020 | 1 | - | + | - FAN +